# EAGLE schematic All-in-one Starter Kit for ESP32 P4_V1.0 (EAGLE 9.6.2)
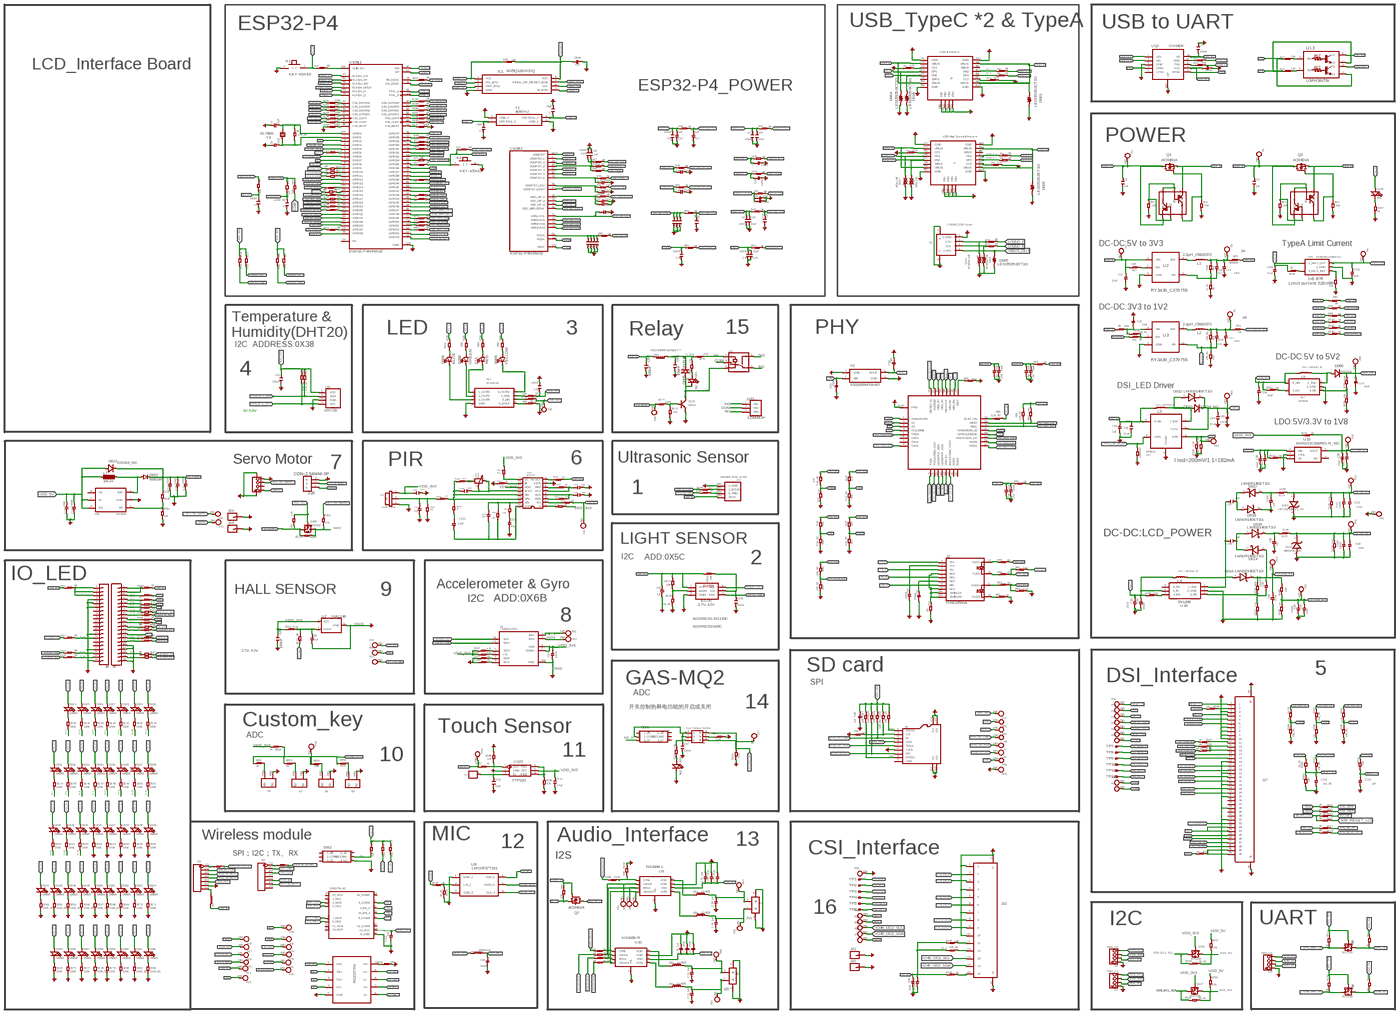
[diagram p0: schematic, sheet 1, overview]
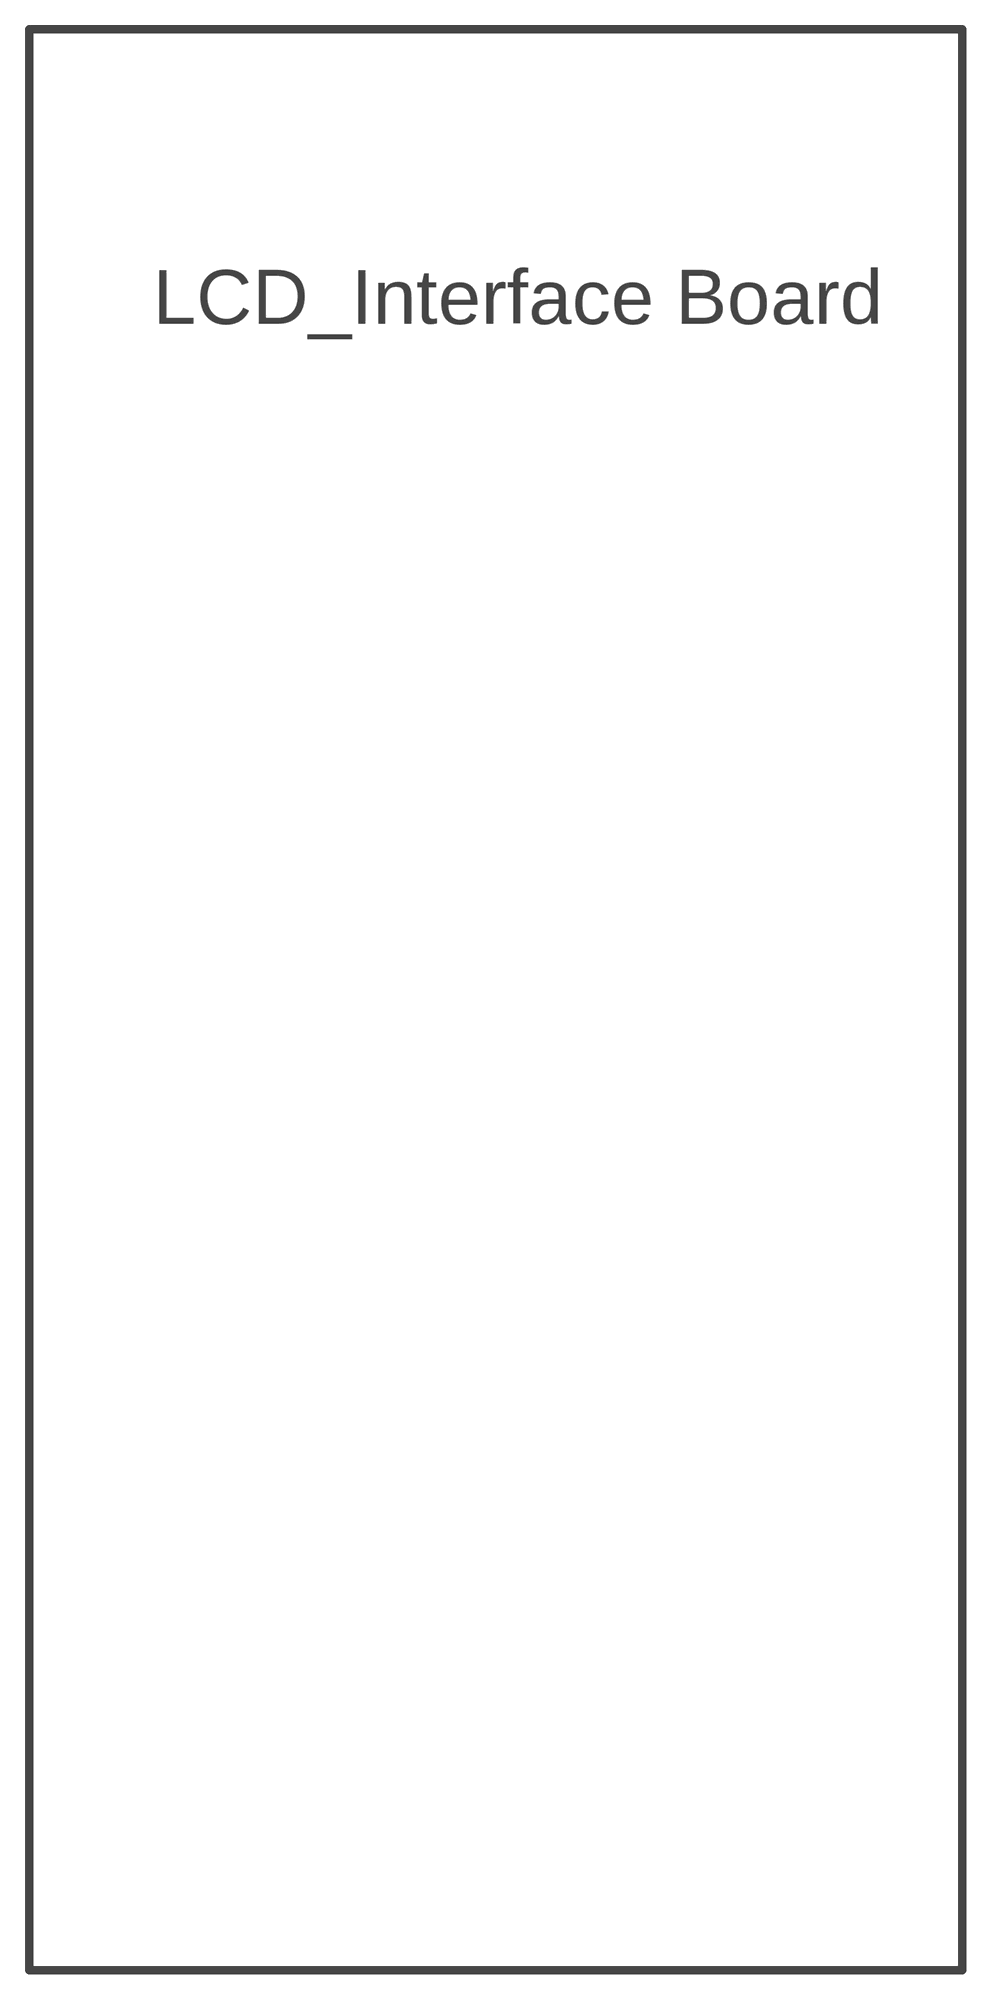
[diagram p1: schematic, sheet 1, part 1 of 8]
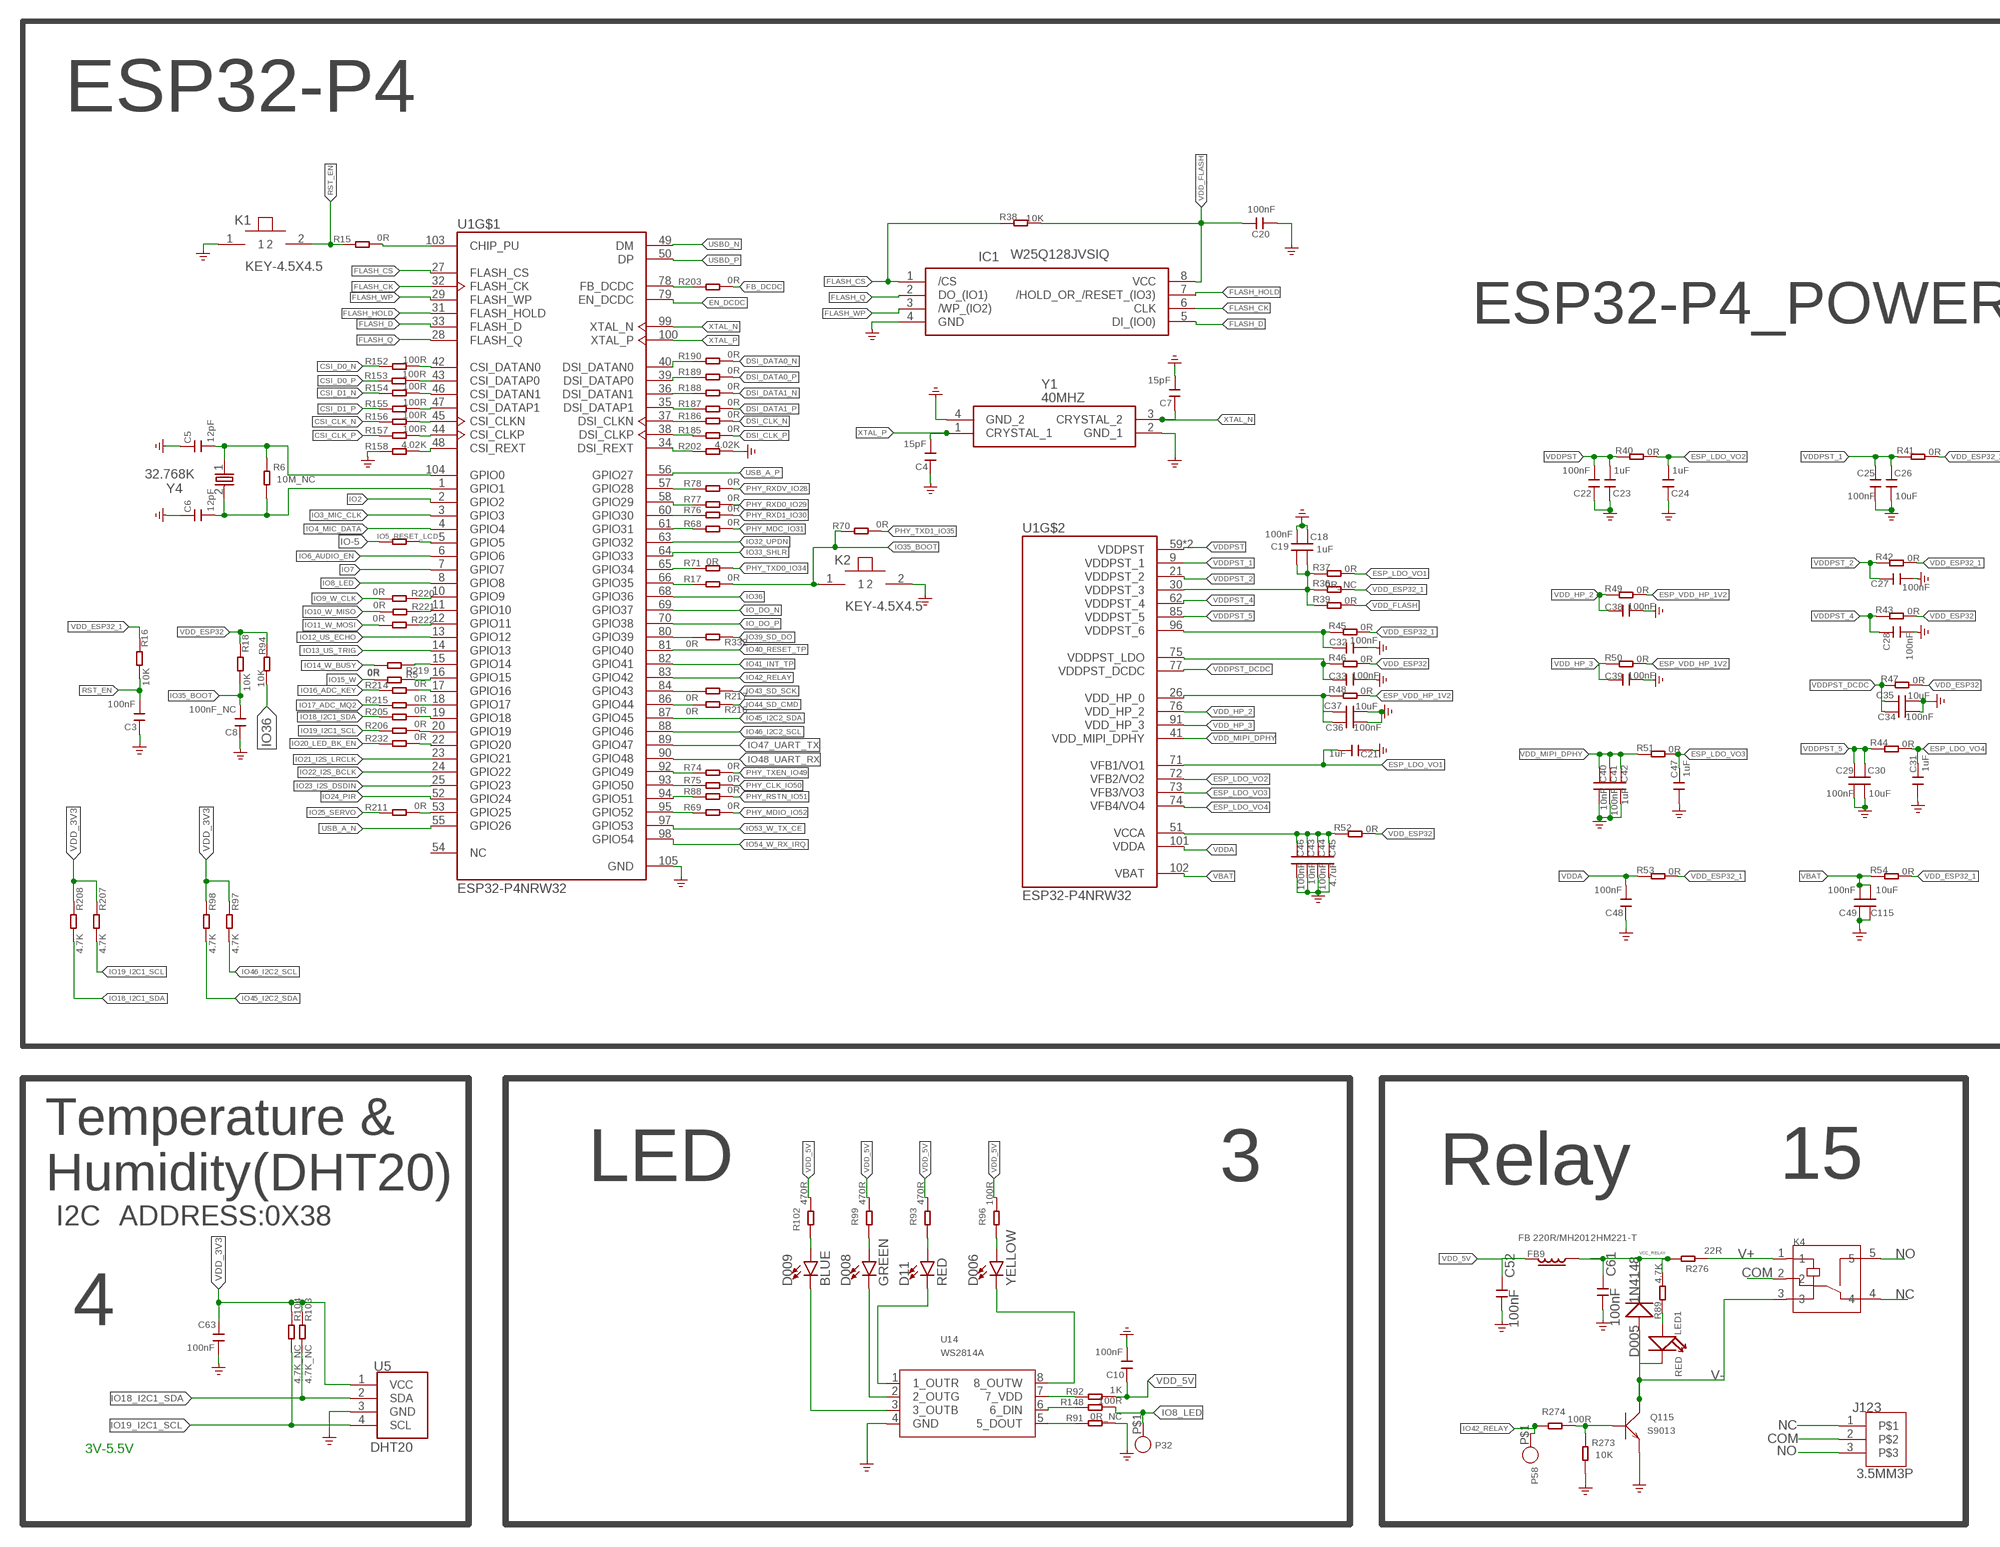
[diagram p2: schematic, sheet 1, part 2 of 8]
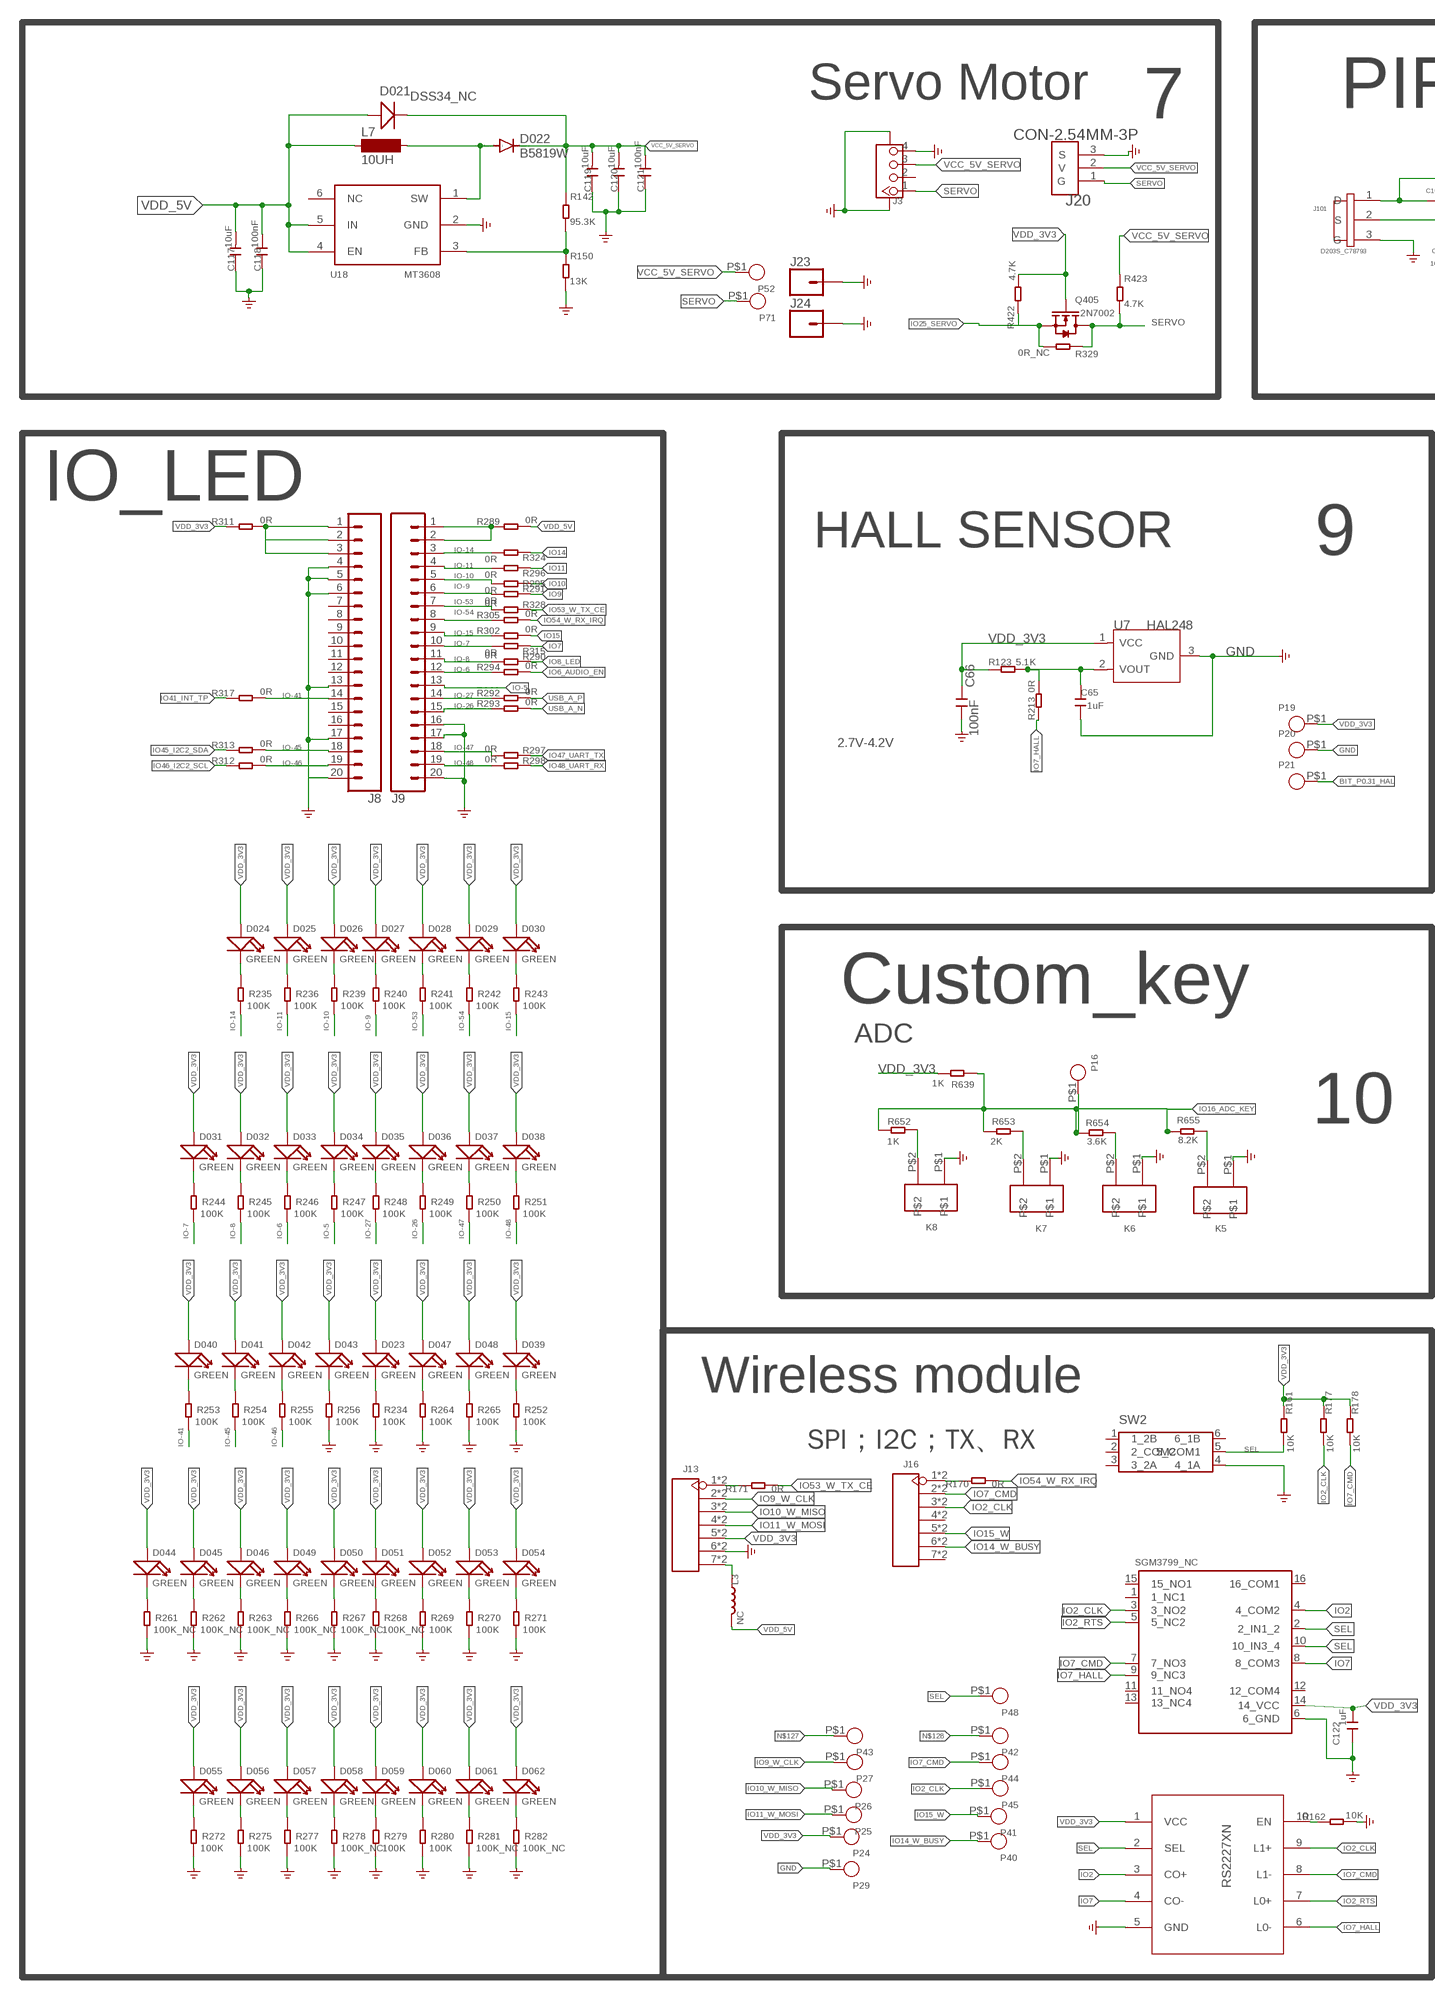
[diagram p3: schematic, sheet 1, part 3 of 8]
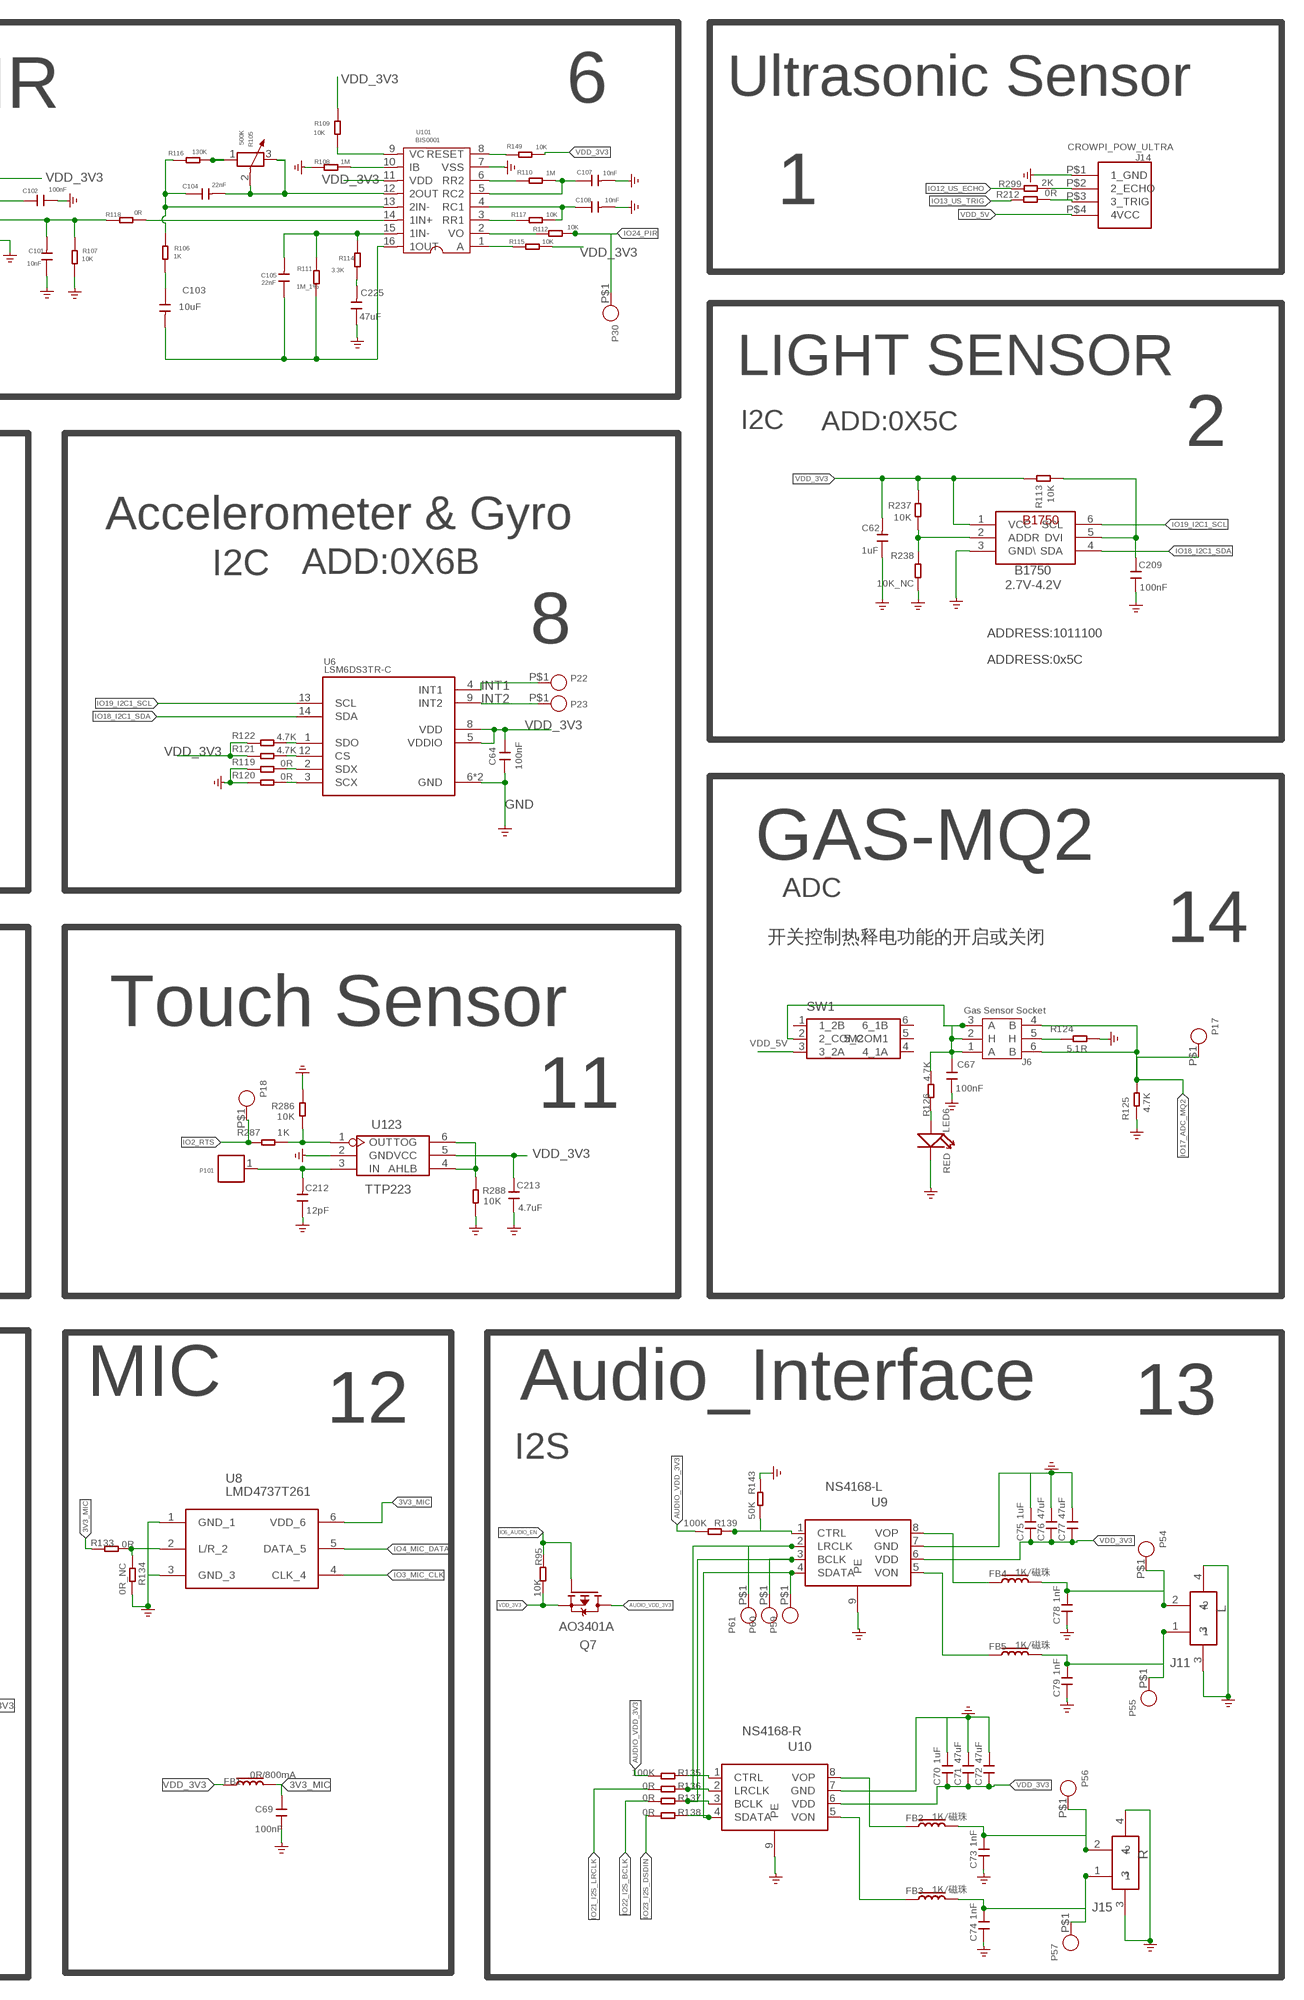
[diagram p4: schematic, sheet 1, part 4 of 8]
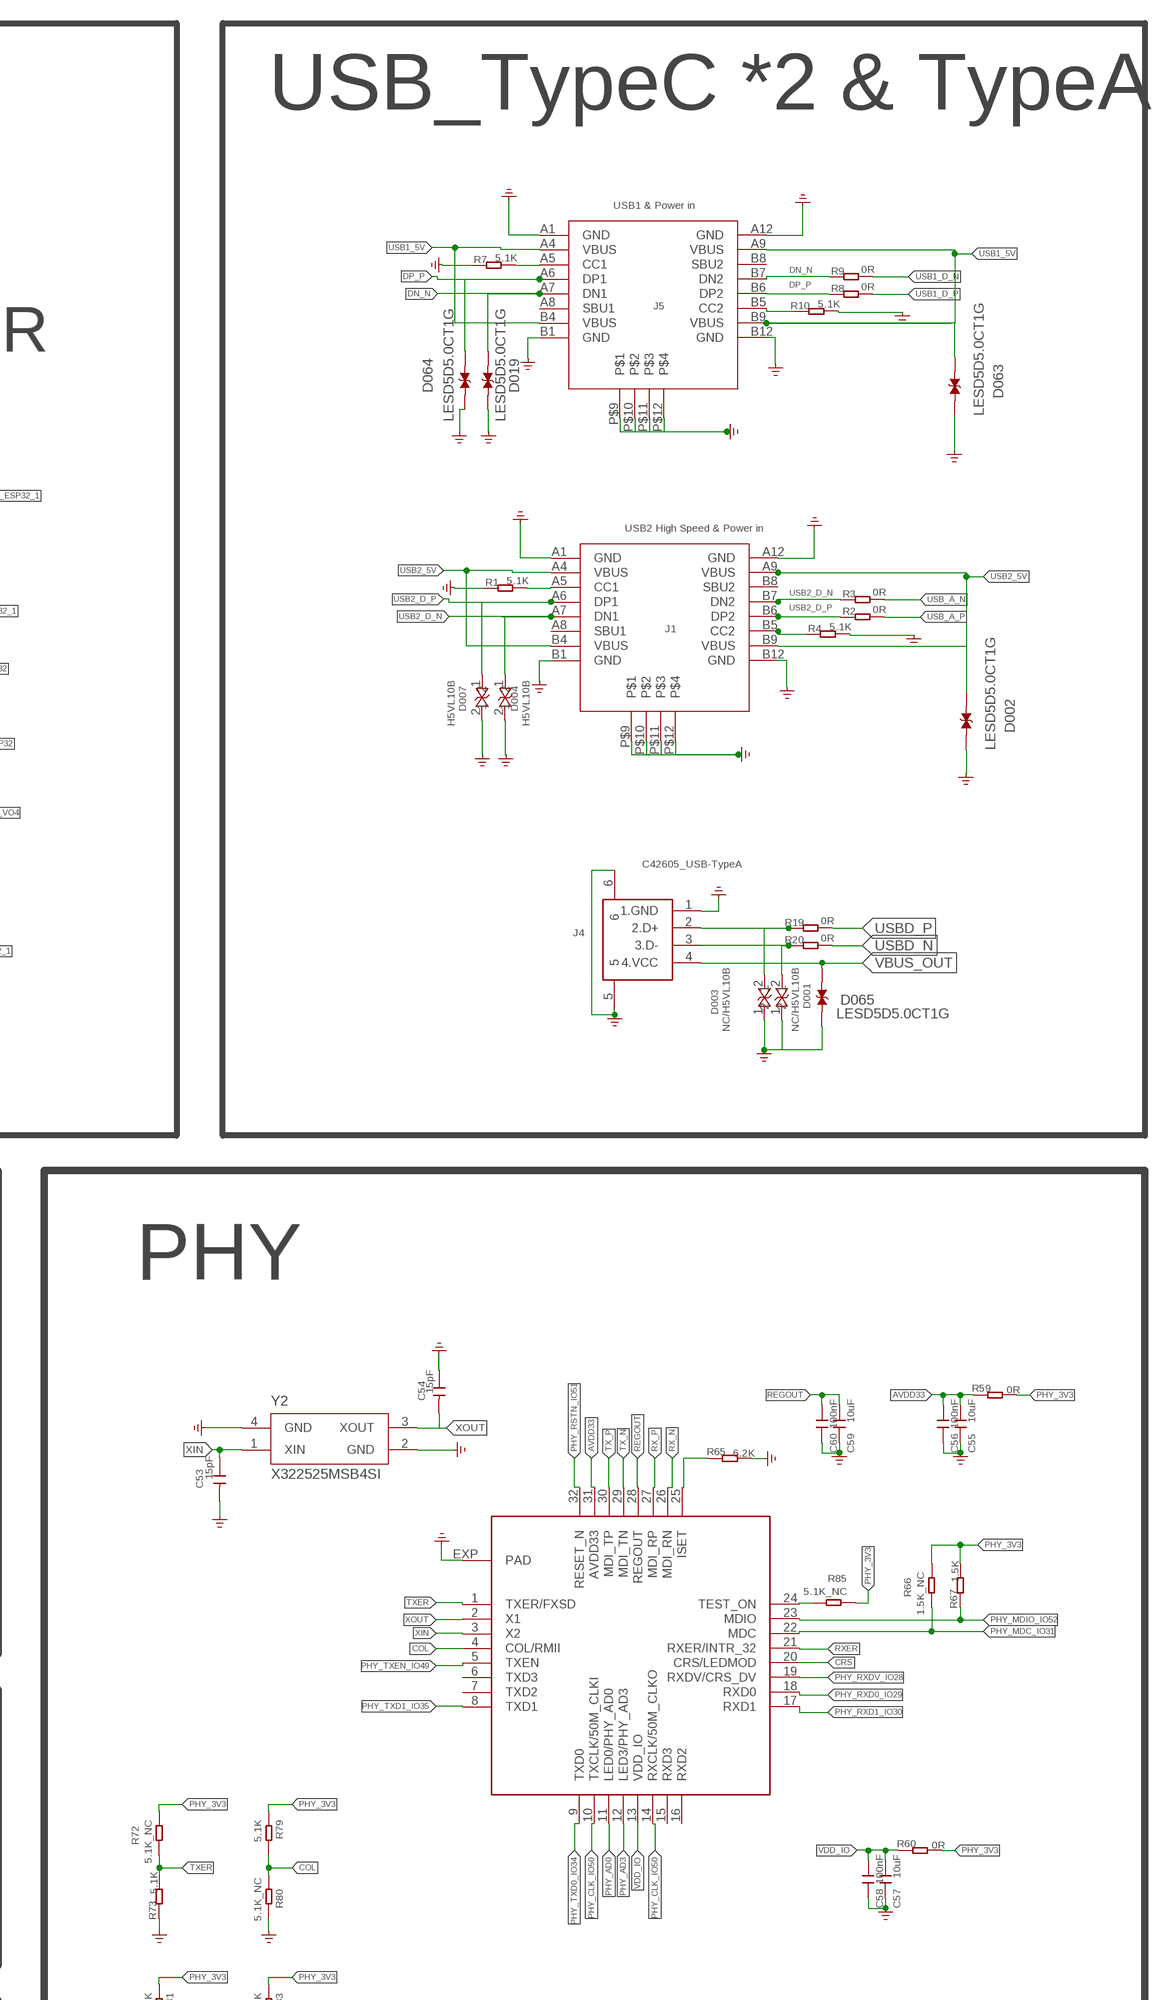
[diagram p5: schematic, sheet 1, part 5 of 8]
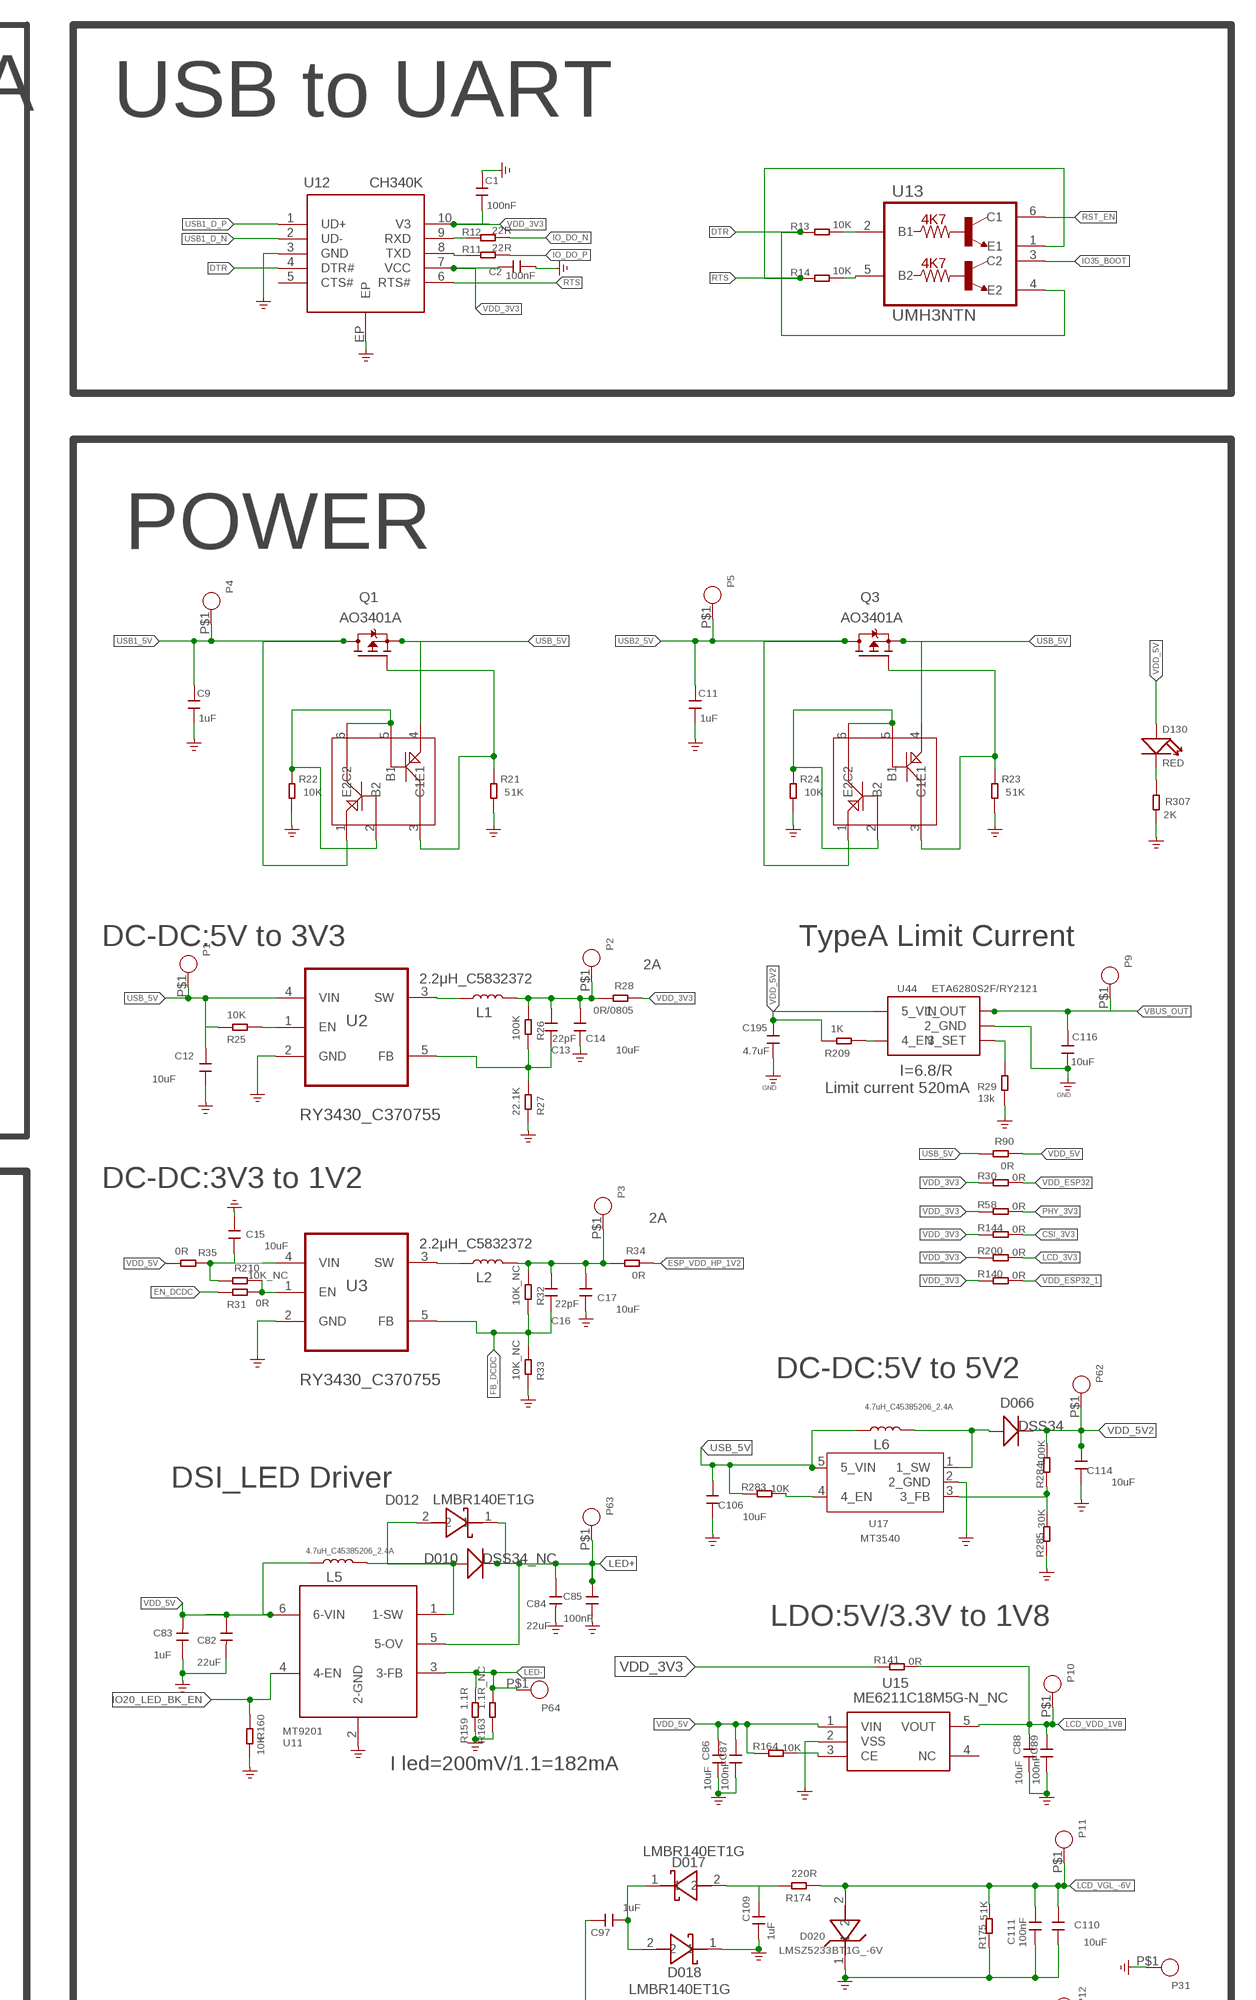
[diagram p6: schematic, sheet 1, part 6 of 8]
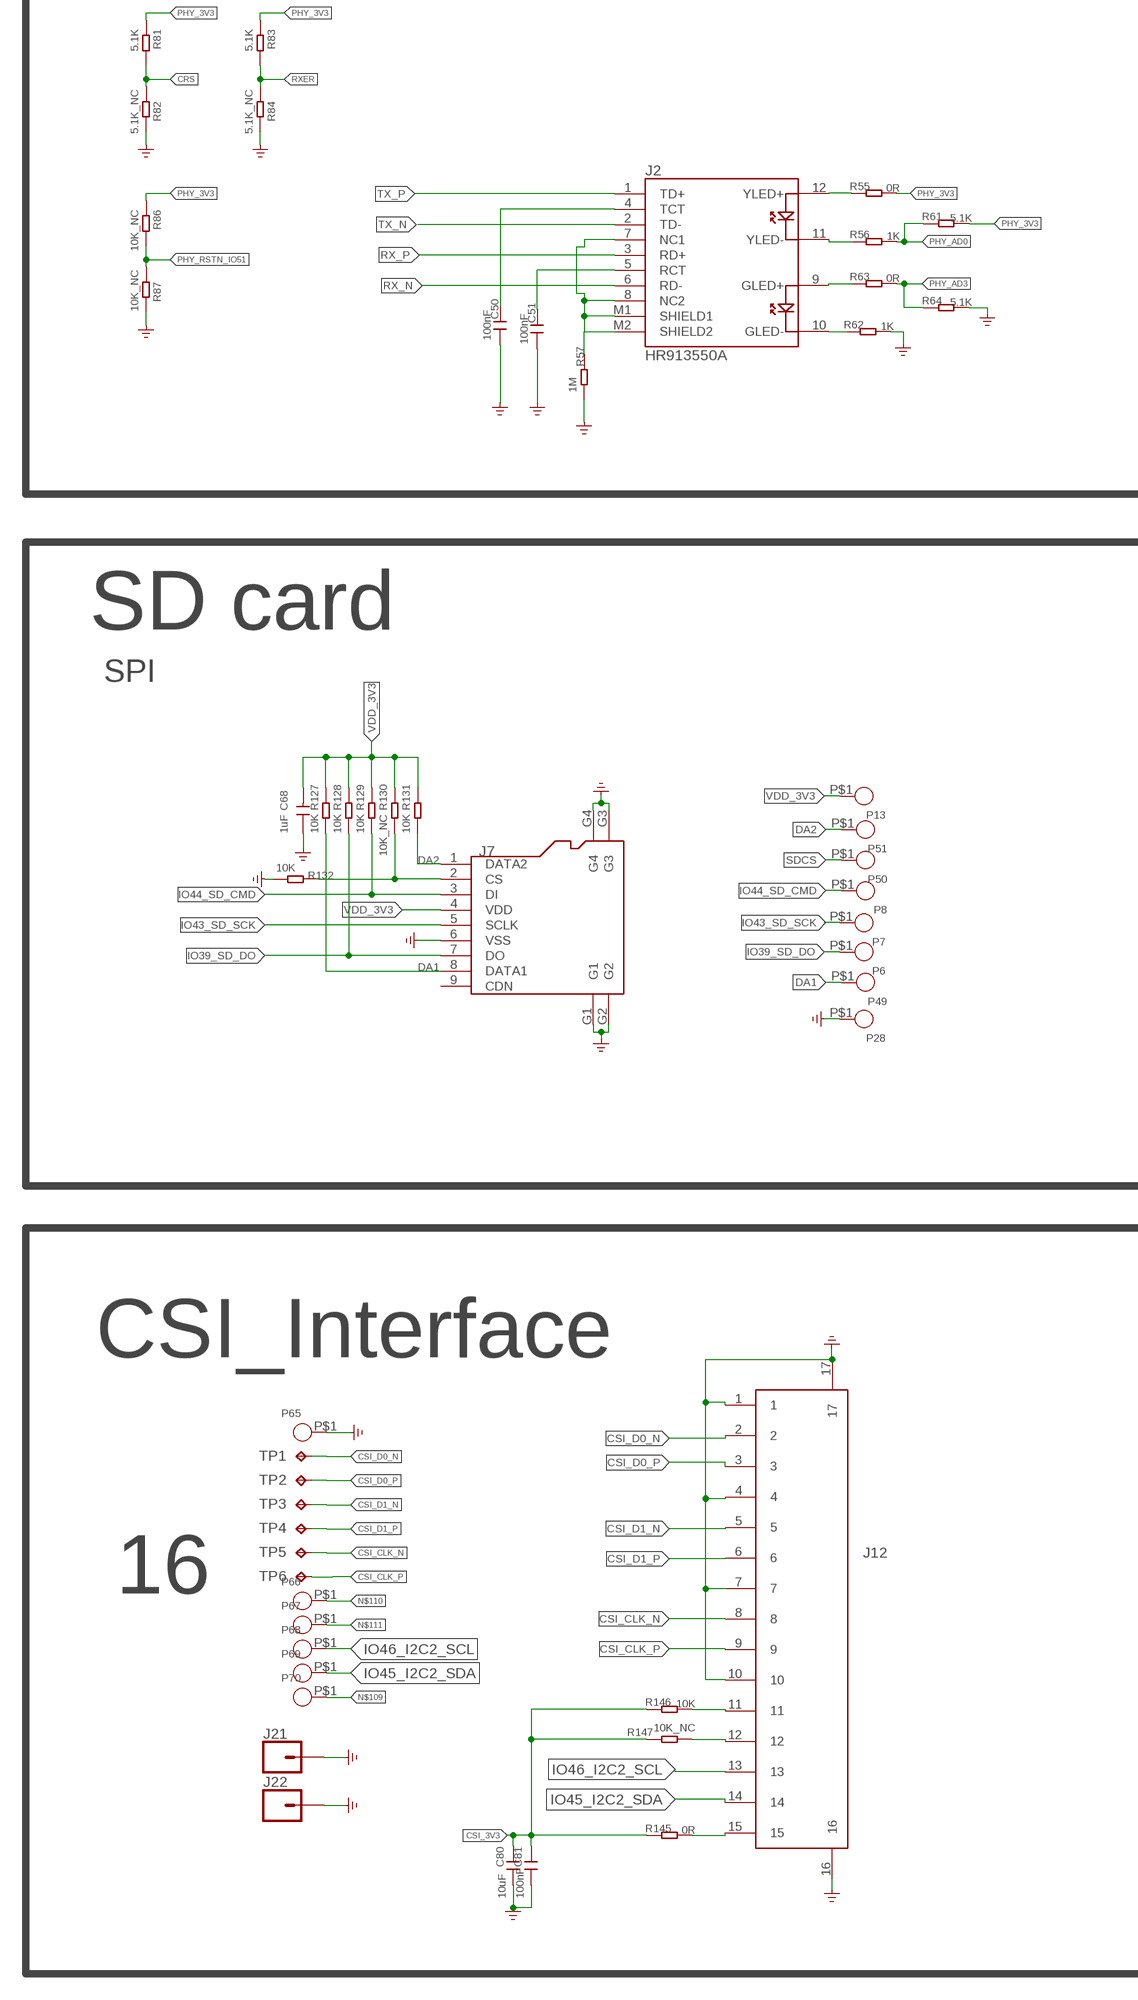
[diagram p7: schematic, sheet 1, part 7 of 8]
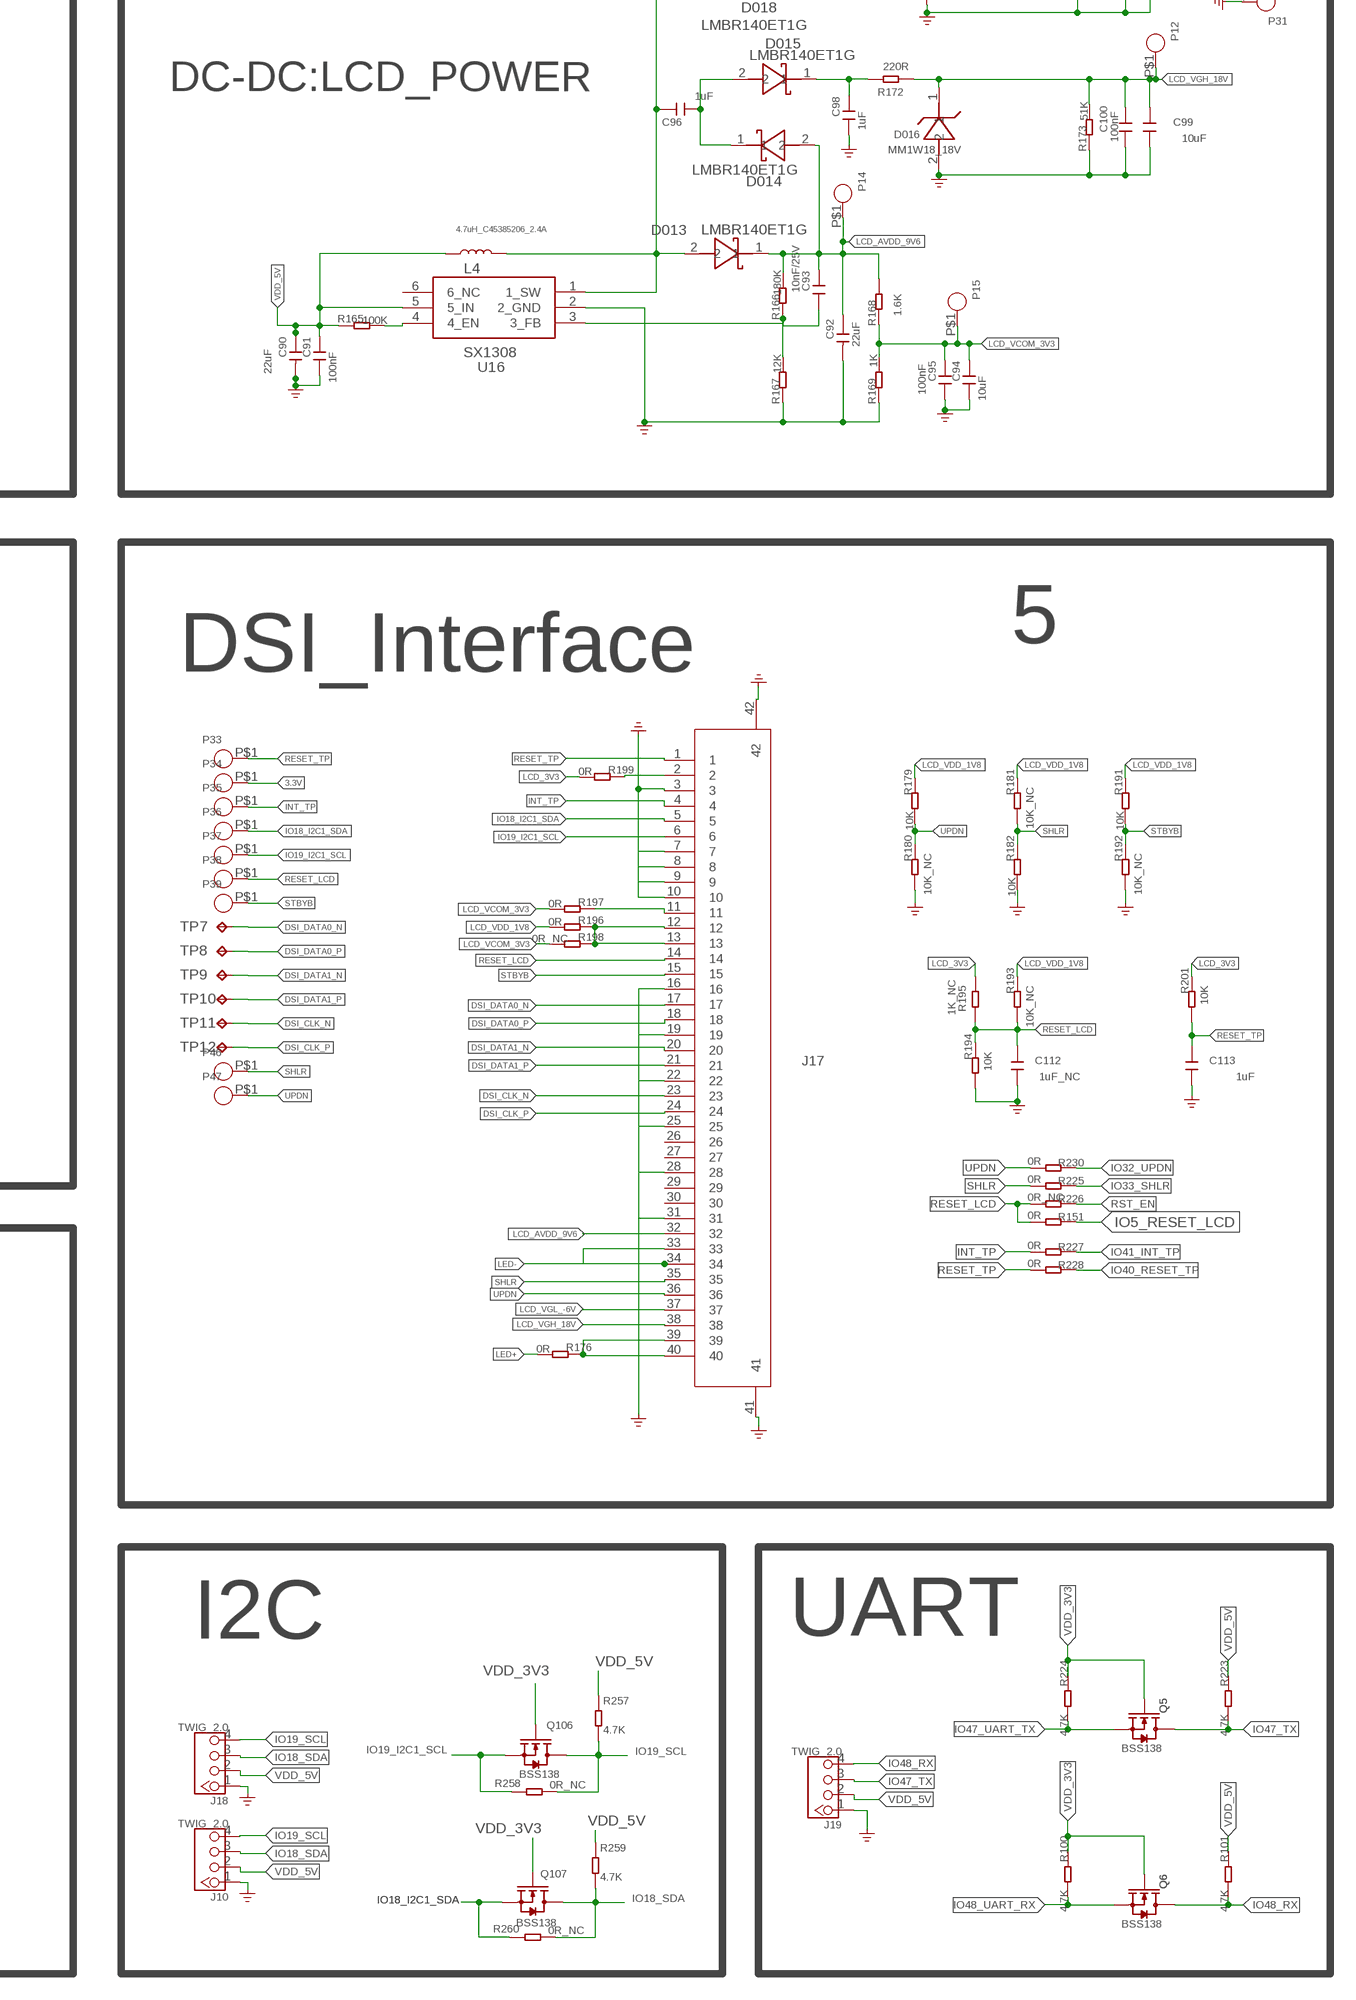
[diagram p8: schematic, sheet 1, part 8 of 8]

## Parts
C1  100nF  C0603  [0603]
C2  100nF  C0603  [0603]
C3  100nF  C0603  [0603]
C4  15pF  C0603  [0603]
C5  12pF  C0603  [0603]
C6  12pF  C0603  [0603]
C7  15pF  C0603  [0603]
C8  100nF_NC  C0603  [0603]
C9  1uF  C0603  [0603]
C10  100nF  C0603  [0603]
C11  1uF  C0603  [0603]
C12  10uF  C0603  [0603]
C13  22pF  C0603  [0603]
C14  10uF  C0603  [0603]
C15  10uF  C0603  [0603]
C16  22pF  C0603  [0603]
C17  10uF  C0603  [0603]
C18  1uF  C0603  [0603]
C19  100nF  C0603  [0603]
C20  100nF  C0603  [0603]
C21  1uF  C0603  [0603]
C22  100nF  C0603  [0603]
C23  1uF  C0603  [0603]
C24  1uF  C0603  [0603]
C25  100nF  C0603  [0603]
C26  10uF  C0603  [0603]
C27  100nF  C0603  [0603]
C28  100nF  C0603  [0603]
C29  100nF  C0603  [0603]
C30  10uF  C0603  [0603]
C31  1uF  C0603  [0603]
C32  100nF  C0603  [0603]
C33  100nF  C0603  [0603]
C34  100nF  C0603  [0603]
C35  10uF  C0603  [0603]
C36  100nF  C0603  [0603]
C37  10uF  C0603  [0603]
C38  100nF  C0603  [0603]
C39  100nF  C0603  [0603]
C40  10nF  C0603  [0603]
C41  100nF  C0603  [0603]
C42  1uF  C0603  [0603]
C43  10nF  C0603  [0603]
C44  100nF  C0603  [0603]
C45  4.7uF  C0603  [0603]
C46  100nF  C0603  [0603]
C47  1uF  C0603  [0603]
C48  100nF  C0603  [0603]
C49  100nF  C0603  [0603]
C50  100nF  C0603  [0603]
C51  100nF  C0603  [0603]
C52  100nF  C0603  [0603]
C53  15pF  CAPC0603  [C0603]
C54  15pF  CAPC0603  [C0603]
C55  10uF  C0603  [0603]
C56  100nF  C0603  [0603]
C57  10uF  C0603  [0603]
C58  100nF  C0603  [0603]
C59  10uF  C0603  [0603]
C60  100nF  C0603  [0603]
C61  100nF  C0603  [0603]
C62  1uF  CAPC0603  [C0603]
C63  100nF  C0603  [0603]
C64  100nF  C0603  [0603]
C65  1uF  C0603  [0603]
C66  100nF  C0603  [0603]
C67  100nF  C0603  [0603]
C68  1uF  CAP  [C0603]
C69  100nF  C0603  [0603]
C70  1uF  C0603  [0603]
C71  47uF  C0603  [0603]
C72  47uF  C0603  [0603]
C73  1nF  C0603  [0603]
C74  1nF  C0603  [0603]
C75  1uF  C0603  [0603]
C76  47uF  C0603  [0603]
C77  47uF  C0603  [0603]
C78  1nF  C0603  [0603]
C79  1nF  C0603  [0603]
C80  10uF  C0603  [0603]
C81  100nF  C0603  [0603]
C82  22uF  CAPC0805  [C0805]
C83  1uF  CAP  [C0603]
C84  22uF  CAPC0805  [C0805]
C85  100nF  C0603  [0603]
C86  10uF  C0603  [0603]
C87  100nF  C0603  [0603]
C88  10uF  C0603  [0603]
C89  100nF  C0603  [0603]
C90  22uF  C0805  [C0805]
C91  100nF  C0603  [0603]
C92  22uF  C0805  [C0805]
C93  10nF/25V  C0603  [0603]
C94  10uF  C0603  [0603]
C95  100nF  C0603  [0603]
C96  1uF  C0603  [0603]
C97  1uF  C0603  [0603]
C98  1uF  C0603  [0603]
C99  10uF  C0603  [0603]
C100  100nF  C0603  [0603]
C101  10nF  C-0603  [C0603]
C102  100nF  C0603  [0603]
C103  10uF  C0603  [0603]
C104  22nF  C-0603  [C0603]
C105  22nF  C-0603  [C0603]
C106  10uF  C0603  [0603]
C107  10nF  C-0603  [C0603]
C108  10nF  C-0603  [C0603]
C109  1uF  C0603  [0603]
C110  10uF  C0603  [0603]
C111  100nF  C0603  [0603]
C112  1uF_NC  C0603  [0603]
C113  1uF  C0603  [0603]
C114  10uF  C0603  [0603]
C115  10uF  C0603  [0603]
C116  10uF  C0603  [0603]
C117  10uF  CAP  [C0603]
C118  100nF  C0603  [0603]
C119  10uF  CAP  [C0603]
C120  10uF  CAP  [C0603]
C121  100nF  C0603  [0603]
C122  1uF  C0603  [0603]
C195  4.7uF  C0603  [0603]
C209  100nF  C0603  [0603]
C212  12pF  CAPC0603  [C0603]
C213  4.7uF  C0603  [0603]
C225  47uF  CAPC0805  [C0805]
D001  NC/H5VL10B  H5VL10B  [H5VL10B]
D002  LESD5D5.0CT1G  [TVS_LESD5D5.0CT1G]
D003  NC/H5VL10B  H5VL10B  [H5VL10B]
D004  H5VL10B  [H5VL10B]
D005  1N4148  DIODE1206  [D_SOD123]
D006  YELLOW  LED  [LED-8MM]
D007  H5VL10B  [H5VL10B]
D008  GREEN  LED  [LED-8MM]
D009  BLUE  LED  [LED-8MM]
D010  DSS34_NC  DIODE  [D_SOD123FL]
D11  RED  LED  [LED-8MM]
D012  LMBR140ET1G  [LMBR140ET1G]
D013  LMBR140ET1G  [LMBR140ET1G]
D014  LMBR140ET1G  [LMBR140ET1G]
D015  LMBR140ET1G  [LMBR140ET1G]
D016  MM1W18_18V  LMSZ5233BT1G  [LMSZ5233BT1G]
D017  LMBR140ET1G  [LMBR140ET1G]
D018  LMBR140ET1G  [LMBR140ET1G]
D019  LESD5D5.0CT1G  [TVS_LESD5D5.0CT1G]
D020  LMSZ5233BT1G_-6V  LMSZ5233BT1G  [LMSZ5233BT1G]
D021  DSS34_NC  DIODE  [D_SOD123FL]
D022  B5819W  CGRM4001-G  [SOD-123_MINI-SMA]
D023  GREEN  LED_0603_SMT  [LED_0603_SMT]
D024  GREEN  LED_0603_SMT  [LED_0603_SMT]
D025  GREEN  LED_0603_SMT  [LED_0603_SMT]
D026  GREEN  LED_0603_SMT  [LED_0603_SMT]
D027  GREEN  LED_0603_SMT  [LED_0603_SMT]
D028  GREEN  LED_0603_SMT  [LED_0603_SMT]
D029  GREEN  LED_0603_SMT  [LED_0603_SMT]
D030  GREEN  LED_0603_SMT  [LED_0603_SMT]
D031  GREEN  LED_0603_SMT  [LED_0603_SMT]
D032  GREEN  LED_0603_SMT  [LED_0603_SMT]
D033  GREEN  LED_0603_SMT  [LED_0603_SMT]
D034  GREEN  LED_0603_SMT  [LED_0603_SMT]
D035  GREEN  LED_0603_SMT  [LED_0603_SMT]
D036  GREEN  LED_0603_SMT  [LED_0603_SMT]
D037  GREEN  LED_0603_SMT  [LED_0603_SMT]
D038  GREEN  LED_0603_SMT  [LED_0603_SMT]
D039  GREEN  LED_0603_SMT  [LED_0603_SMT]
D040  GREEN  LED_0603_SMT  [LED_0603_SMT]
D041  GREEN  LED_0603_SMT  [LED_0603_SMT]
D042  GREEN  LED_0603_SMT  [LED_0603_SMT]
D043  GREEN  LED_0603_SMT  [LED_0603_SMT]
D044  GREEN  LED_0603_SMT  [LED_0603_SMT]
D045  GREEN  LED_0603_SMT  [LED_0603_SMT]
D046  GREEN  LED_0603_SMT  [LED_0603_SMT]
D047  GREEN  LED_0603_SMT  [LED_0603_SMT]
D048  GREEN  LED_0603_SMT  [LED_0603_SMT]
D049  GREEN  LED_0603_SMT  [LED_0603_SMT]
D050  GREEN  LED_0603_SMT  [LED_0603_SMT]
D051  GREEN  LED_0603_SMT  [LED_0603_SMT]
D052  GREEN  LED_0603_SMT  [LED_0603_SMT]
D053  GREEN  LED_0603_SMT  [LED_0603_SMT]
D054  GREEN  LED_0603_SMT  [LED_0603_SMT]
D055  GREEN  LED_0603_SMT  [LED_0603_SMT]
D056  GREEN  LED_0603_SMT  [LED_0603_SMT]
D057  GREEN  LED_0603_SMT  [LED_0603_SMT]
D058  GREEN  LED_0603_SMT  [LED_0603_SMT]
D059  GREEN  LED_0603_SMT  [LED_0603_SMT]
D060  GREEN  LED_0603_SMT  [LED_0603_SMT]
D061  GREEN  LED_0603_SMT  [LED_0603_SMT]
D062  GREEN  LED_0603_SMT  [LED_0603_SMT]
D063  LESD5D5.0CT1G  [TVS_LESD5D5.0CT1G]
D064  LESD5D5.0CT1G  [TVS_LESD5D5.0CT1G]
D065  LESD5D5.0CT1G  [TVS_LESD5D5.0CT1G]
D066  DSS34  DIODE  [D_SOD123FL]
D130  RED  LED_0603_SMT  [LED_0603_SMT]
FB1  0R/800mA  FBL0603  [L0603]
FB2  1K/磁珠  FBL0603  [L0603]
FB3  1K/磁珠  FBL0603  [L0603]
FB4  1K/磁珠  FBL0603  [L0603]
FB5  1K/磁珠  FBL0603  [L0603]
FB9  FB 220R/MH2012HM221-T  FBL0805  [L0805]
IC1  W25Q128JVSIQ  [SOIC127P790X216-8N]
J1  USB2 High Speed & Power in  WZ3532R024-ESP32-V0.1-20221226_USB_TYPE-C_16PIN3.0USB  [WZ3532R024-ESP32-V0.1-20221226_KEVIN_3.0TYPEC-SMD]
J2  HR913550A  LORA_BASIC_GATEWAY_-MODULE_HR911105A-RJ45  [LORA_BASIC_GATEWAY_-MODULE_HR911105A-RJ45]
J3  A_XBJ_CONNECTOR_TWIG-4P-2.0-SMD-FEMALE-REINFORCE90D  [A_XBJ_CONNECTOR_4P-SMD-2.0-90D]
J4  C42605_USB-TypeA  C42605/USB2.0  [C42605/USB2.0]
J5  USB1 & Power in  WZ3532R024-ESP32-V0.1-20221226_USB_TYPE-C_16PIN3.0USB  [WZ3532R024-ESP32-V0.1-20221226_KEVIN_3.0TYPEC-SMD]
J6  Gas Sensor Socket  MQ-SOCKET  [MQ2]
J7  HOLDER-MICROSD-9P  [9P-SMD-W/-RING]
J8  CONN_20  [1X20]
J9  CONN_20  [1X20]
J10  TWIG_2.0  [2.0_1X4]
J11  L  1X02L  [1X02L]
J12  C262349_15P_1MM_下接_AFA07-S15FCC-00  [C262349_15P_1MM_下接_AFA07-S15FCC-00]
J13  HEADER-7P-18.28X2.5  [H7-2.54-18.28X2.5X5MM]
J14  CROWPI_POW_ULTRA  [CROWPI_POW_ULTRA]
J15  R  1X02L  [1X02L]
J16  HEADER-7P-18.28X2.5  [H7-2.54-18.28X2.5X5MM]
J17  C19273935_40P_0.5MM_下接_HC-FPC-0.5-40P-FH20  [C19273935_40P_0.5MM_下接_HC-FPC-0.5-40P-FH20]
J18  TWIG_2.0  [2.0_1X4]
J19  TWIG_2.0  [2.0_1X4]
J20  CON-2.54MM-3P  CON-2.54MM-13P-WT-SG90  [CON-PZ-2.54MM-1*3P-WT]
J21  CONN_01_3.1MM_SMD1X01_3.1MM_SMD  [1X01_2MM]
J22  CONN_01_3.1MM_SMD1X01_3.1MM_SMD  [1X01_2MM]
J23  CONN_01_2.6MM1X01_2.6-4MM  [1X01_2.6MM]
J24  CONN_01_2.6MM1X01_2.6-4MM  [1X01_2.6MM]
J101  D203S_C78793  LHI778  [3P-D8.1MM]
J123  3.5MM3P  [3.5MM*3P]
K1  KEY-4.5X4.5  KEY-6KEY-4.5X4.5  [KEY-4.5X4.5-SMD]
K2  KEY-4.5X4.5  KEY-6KEY-4.5X4.5  [KEY-4.5X4.5-SMD]
K4  RELAY-SRD  [REY5-6-19.1X15.5X15.3MM]
K5  BUTTON_2P  [BUTTON_2P]
K6  BUTTON_2P  [BUTTON_2P]
K7  BUTTON_2P  [BUTTON_2P]
K8  BUTTON_2P  [BUTTON_2P]
L1  2.2μH_C5832372  4.7μH_SHIELDED_INDUCTOR  [1008(2520)]
L2  2.2μH_C5832372  4.7μH_SHIELDED_INDUCTOR  [1008(2520)]
L3  NC  L0603  [L0603]
L4  4.7uH_C45385206_2.4A  4.7μH_SHIELDED_INDUCTOR  [1008(2520)]
L5  4.7uH_C45385206_2.4A  4.7μH_SHIELDED_INDUCTOR  [1008(2520)]
L6  4.7uH_C45385206_2.4A  4.7μH_SHIELDED_INDUCTOR  [1008(2520)]
L7  10UH  MS42SMD-4X4MM  [SMD-4X4MM]
LED1  RED  DISCRETE_LED0603  [DISCRETE_LED-0603]
LED6  RED  DISCRETE_LED0603  [DISCRETE_LED-0603]
P1  TEST_PADPAD-1.5MM  [TEST_PAD-1.5MM]
P2  TEST_PADPAD-1.5MM  [TEST_PAD-1.5MM]
P3  TEST_PADPAD-1.5MM  [TEST_PAD-1.5MM]
P4  TEST_PADPAD-1.5MM  [TEST_PAD-1.5MM]
P5  TEST_PADPAD-1.5MM  [TEST_PAD-1.5MM]
P6  TEST_PADPAD-1.5MM  [TEST_PAD-1.5MM]
P7  TEST_PADPAD-1.5MM  [TEST_PAD-1.5MM]
P8  TEST_PADPAD-1.5MM  [TEST_PAD-1.5MM]
P9  TEST_PADPAD-1.5MM  [TEST_PAD-1.5MM]
P10  TEST_PADPAD-1.5MM  [TEST_PAD-1.5MM]
P11  TEST_PADPAD-1.5MM  [TEST_PAD-1.5MM]
P12  TEST_PADPAD-1.5MM  [TEST_PAD-1.5MM]
P13  TEST_PADPAD-1.5MM  [TEST_PAD-1.5MM]
P14  TEST_PADPAD-1.5MM  [TEST_PAD-1.5MM]
P15  TEST_PADPAD-1.5MM  [TEST_PAD-1.5MM]
P16  TEST_PADPAD-1.5MM  [TEST_PAD-1.5MM]
P17  TEST_PADPAD-1.5MM  [TEST_PAD-1.5MM]
P18  TEST_PADPAD-1.5MM  [TEST_PAD-1.5MM]
P19  TEST_PADPAD-1.5MM  [TEST_PAD-1.5MM]
P20  TEST_PADPAD-1.5MM  [TEST_PAD-1.5MM]
P21  TEST_PADPAD-1.5MM  [TEST_PAD-1.5MM]
P22  TEST_PADPAD-1.5MM  [TEST_PAD-1.5MM]
P23  TEST_PADPAD-1.5MM  [TEST_PAD-1.5MM]
P24  TEST_PADPAD-1.5MM  [TEST_PAD-1.5MM]
P25  TEST_PADPAD-1.5MM  [TEST_PAD-1.5MM]
P26  TEST_PADPAD-1.5MM  [TEST_PAD-1.5MM]
P27  TEST_PADPAD-1.5MM  [TEST_PAD-1.5MM]
P28  TEST_PADPAD-1.5MM  [TEST_PAD-1.5MM]
P29  TEST_PADPAD-1.5MM  [TEST_PAD-1.5MM]
P30  TEST_PADPAD-1.5MM  [TEST_PAD-1.5MM]
P31  TEST_PADPAD-1.5MM  [TEST_PAD-1.5MM]
P32  TEST_PADPAD-1.5MM  [TEST_PAD-1.5MM]
P33  TEST_PADPAD-1.5MM  [TEST_PAD-1.5MM]
P34  TEST_PADPAD-1.5MM  [TEST_PAD-1.5MM]
P35  TEST_PADPAD-1.5MM  [TEST_PAD-1.5MM]
P36  TEST_PADPAD-1.5MM  [TEST_PAD-1.5MM]
P37  TEST_PADPAD-1.5MM  [TEST_PAD-1.5MM]
P38  TEST_PADPAD-1.5MM  [TEST_PAD-1.5MM]
P39  TEST_PADPAD-1.5MM  [TEST_PAD-1.5MM]
P40  TEST_PADPAD-1.5MM  [TEST_PAD-1.5MM]
P41  TEST_PADPAD-1.5MM  [TEST_PAD-1.5MM]
P42  TEST_PADPAD-1.5MM  [TEST_PAD-1.5MM]
P43  TEST_PADPAD-1.5MM  [TEST_PAD-1.5MM]
P44  TEST_PADPAD-1.5MM  [TEST_PAD-1.5MM]
P45  TEST_PADPAD-1.5MM  [TEST_PAD-1.5MM]
P46  TEST_PADPAD-1.5MM  [TEST_PAD-1.5MM]
P47  TEST_PADPAD-1.5MM  [TEST_PAD-1.5MM]
P48  TEST_PADPAD-1.5MM  [TEST_PAD-1.5MM]
P49  TEST_PADPAD-1.5MM  [TEST_PAD-1.5MM]
P50  TEST_PADPAD-1.5MM  [TEST_PAD-1.5MM]
P51  TEST_PADPAD-1.5MM  [TEST_PAD-1.5MM]
P52  TEST_PADPAD-1.5MM  [TEST_PAD-1.5MM]
P54  TEST_PADPAD-1.5MM  [TEST_PAD-1.5MM]
P55  TEST_PADPAD-1.5MM  [TEST_PAD-1.5MM]
P56  TEST_PADPAD-1.5MM  [TEST_PAD-1.5MM]
P57  TEST_PADPAD-1.5MM  [TEST_PAD-1.5MM]
P58  TEST_PADPAD-1.5MM  [TEST_PAD-1.5MM]
P59  TEST_PADPAD-1.5MM  [TEST_PAD-1.5MM]
P60  TEST_PADPAD-1.5MM  [TEST_PAD-1.5MM]
P61  TEST_PADPAD-1.5MM  [TEST_PAD-1.5MM]
P62  TEST_PADPAD-1.5MM  [TEST_PAD-1.5MM]
P63  TEST_PADPAD-1.5MM  [TEST_PAD-1.5MM]
P64  TEST_PADPAD-1.5MM  [TEST_PAD-1.5MM]
P65  TEST_PADPAD-1.5MM  [TEST_PAD-1.5MM]
P66  TEST_PADPAD-1.5MM  [TEST_PAD-1.5MM]
P67  TEST_PADPAD-1.5MM  [TEST_PAD-1.5MM]
P68  TEST_PADPAD-1.5MM  [TEST_PAD-1.5MM]
P69  TEST_PADPAD-1.5MM  [TEST_PAD-1.5MM]
P70  TEST_PADPAD-1.5MM  [TEST_PAD-1.5MM]
P71  TEST_PADPAD-1.5MM  [TEST_PAD-1.5MM]
P101  KEY  PAD'D450MIL'  [1P-D450]
Q1  AO3401A  [SOT23-3]
Q2  LMBT3906DW1T1G  [LMBT3906DW1T1G]
Q3  AO3401A  [SOT23-3]
Q4  LMBT3906DW1T1G  [LMBT3906DW1T1G]
Q5  BSS138  MOSFET-N'SOT23'  [SOT23]
Q6  BSS138  MOSFET-N'SOT23'  [SOT23]
Q7  AO3401A  [SOT23-3]
Q106  BSS138  MOSFET-N'SOT23'  [SOT23]
Q107  BSS138  MOSFET-N'SOT23'  [SOT23]
Q115  S9013  TRANSISTOR-NPN-SOT23  [SOT23@1]
Q405  2N7002  MOSFET-N'SOT23'  [SOT23]
R1  5.1K  R-0603  [R0603]
R2  0R  R-0603  [R0603]
R3  0R  R-0603  [R0603]
R4  5.1K  R-0603  [R0603]
R5  0R  R-0603  [R0603]
R6  10M_NC  R-0603  [R0603]
R7  5.1K  R-0603  [R0603]
R8  0R  R-0603  [R0603]
R9  0R  R-0603  [R0603]
R10  5.1K  R-0603  [R0603]
R11  22R  R-0603  [R0603]
R12  22R  R-0603  [R0603]
R13  10K  R-0603  [R0603]
R14  10K  R-0603  [R0603]
R15  0R  R-0603  [R0603]
R16  10K  R-0603  [R0603]
R17  0R  R-0603  [R0603]
R18  10K  R-0603  [R0603]
R19  0R  R-0603  [R0603]
R20  0R  R-0603  [R0603]
R21  51K  R-0603  [R0603]
R22  10K  R-0603  [R0603]
R23  51K  R-0603  [R0603]
R24  10K  R-0603  [R0603]
R25  10K  R0603  [R0603]
R26  100K  R0603  [R0603]
R27  22.1K  R0603  [R0603]
R28  0R/0805  RES-0805  [R0805-SP]
R29  13k  R0603  [R0603]
R30  0R  R0603  [R0603]
R31  0R  R0603  [R0603]
R32  10K_NC  R0603  [R0603]
R33  10K_NC  R0603  [R0603]
R34  0R  R0603  [R0603]
R35  0R  R0603  [R0603]
R36  0R_NC  R0603  [R0603]
R37  0R  R0603  [R0603]
R38  10K  R0603  [R0603]
R39  0R  R0603  [R0603]
R40  0R  R0603  [R0603]
R41  0R  R0603  [R0603]
R42  0R  R0603  [R0603]
R43  0R  R0603  [R0603]
R44  0R  R0603  [R0603]
R45  0R  R0603  [R0603]
R46  0R  R0603  [R0603]
R47  0R  R0603  [R0603]
R48  0R  R0603  [R0603]
R49  0R  R0603  [R0603]
R50  0R  R0603  [R0603]
R51  0R  R0603  [R0603]
R52  0R  R0603  [R0603]
R53  0R  R0603  [R0603]
R54  0R  R0603  [R0603]
R55  0R  R0603  [R0603]
R56  1K  R0603  [R0603]
R57  1M  RESR0603  [R0603]
R58  0R  R0603  [R0603]
R59  0R  R0603  [R0603]
R60  0R  R0603  [R0603]
R61  5.1K  R0603  [R0603]
R62  1K  R0603  [R0603]
R63  0R  R0603  [R0603]
R64  5.1K  R0603  [R0603]
R65  6.2K  R0603  [R0603]
R66  1.5K_NC  R0603  [R0603]
R67  1.5K  R0603  [R0603]
R68  0R  R-0603  [R0603]
R69  0R  R-0603  [R0603]
R70  0R  R-0603  [R0603]
R71  0R  R-0603  [R0603]
R72  5.1K_NC  R0603  [R0603]
R73  5.1K  R0603  [R0603]
R74  0R  R-0603  [R0603]
R75  0R  R-0603  [R0603]
R76  0R  R-0603  [R0603]
R77  0R  R-0603  [R0603]
R78  0R  R-0603  [R0603]
R79  5.1K  R0603  [R0603]
R80  5.1K_NC  R0603  [R0603]
R81  5.1K  R0603  [R0603]
R82  5.1K_NC  R0603  [R0603]
R83  5.1K  R0603  [R0603]
R84  5.1K_NC  R0603  [R0603]
R85  5.1K_NC  R0603  [R0603]
R86  10K_NC  R0603  [R0603]
R87  10K_NC  R0603  [R0603]
R88  0R  R-0603  [R0603]
R89  4.7K  RESR0603  [R0603]
R90  0R  RES-0805  [R0805-SP]
R91  0R_NC  R-0603  [R0603]
R92  1K  R-0603  [R0603]
R93  470R  R-0603  [R0603]
R94  10K  R0603  [R0603]
R95  10K  R0603  [R0603]
R96  100R  R-0603  [R0603]
R97  4.7K  R0603  [R0603]
R98  4.7K  R0603  [R0603]
R99  470R  R-0603  [R0603]
R100  4.7K  RES-0603  [R0603-SP]
R101  4.7K  RES-0603  [R0603-SP]
R102  470R  R-0603  [R0603]
R103  4.7K_NC  R0603  [R0603]
R104  4.7K_NC  R0603  [R0603]
R105  500K  R-POTENTIOMETER-SMD  [3P-SMD-SQUA-3.6X3.3]
R106  1K  R-0603  [R0603]
R107  10K  R-0603  [R0603]
R108  1M  R-0603  [R0603]
R109  10K  R-0603  [R0603]
R110  1M  R-0603  [R0603]
R111  1M_1%  R-0603  [R0603]
R112  10K  R-0603  [R0603]
R113  10K  RESR0603  [R0603]
R114  3.3K  R-0603  [R0603]
R115  10K  R-0603  [R0603]
R116  130K  R-0603  [R0603]
R117  10K  R-0603  [R0603]
R118  0R  R-0603  [R0603]
R119  0R  RESR0603  [R0603]
R120  0R  RESR0603  [R0603]
R121  4.7K  RESR0603  [R0603]
R122  4.7K  RESR0603  [R0603]
R123  5.1K  R-0603  [R0603]
R124  5.1R  RESR0603  [R0603]
R125  4.7K  RESR0603  [R0603]
R126  4.7K  RESR0603  [R0603]
R127  10K  RES-0603  [R0603-SP]
R128  10K  RES-0603  [R0603-SP]
R129  10K  RES-0603  [R0603-SP]
R130  10K_NC  RES-0603  [R0603-SP]
R131  10K  RES-0603  [R0603-SP]
R132  10K  RES-0603  [R0603-SP]
R133  0R  R0603  [R0603]
R134  0R_NC  R0603  [R0603]
R135  100K  RES-0603  [R0603-SP]
R136  0R  RES-0603  [R0603-SP]
R137  0R  RES-0603  [R0603-SP]
R138  0R  RES-0603  [R0603-SP]
R139  100K  RES-0603  [R0603-SP]
R140  0R  R0603  [R0603]
R141  0R  R0603  [R0603]
R142  95.3K  RESR0603  [R0603]
R143  50K  RES-0603  [R0603-SP]
R144  0R  R0603  [R0603]
R145  0R  R0603  [R0603]
R146  10K  R0603  [R0603]
R147  10K_NC  R0603  [R0603]
R148  100R  R-0603  [R0603]
R149  10K  R-0603  [R0603]
R150  13K  RESR0603  [R0603]
R151  0R  R0603  [R0603]
R152  100R  R-0603  [R0603]
R153  100R  R-0603  [R0603]
R154  100R  R-0603  [R0603]
R155  100R  R-0603  [R0603]
R156  100R  R-0603  [R0603]
R157  100R  R-0603  [R0603]
R158  4.02K  R-0603  [R0603]
R159  1.1R  RES-0603  [R0603-SP]
R160  10K  RES-0603  [R0603-SP]
R161  10K  R-0603  [R0603]
R162  10K  R-0603  [R0603]
R163  1.1R_NC  RES-0603  [R0603-SP]
R164  10K  R0603  [R0603]
R165  100K  R0603  [R0603]
R166  180K  R0603  [R0603]
R167  12K  R0603  [R0603]
R168  1.6K  R0603  [R0603]
R169  1K  R0603  [R0603]
R170  0R  RES-0603  [R0603-SP]
R171  0R  RES-0603  [R0603-SP]
R172  220R  R0603  [R0603]
R173  51K  R0603  [R0603]
R174  220R  R0603  [R0603]
R175  51K  R0603  [R0603]
R176  0R  R0603  [R0603]
R177  10K  R-0603  [R0603]
R178  10K  R-0603  [R0603]
R179  10K  R0603  [R0603]
R180  10K_NC  R0603  [R0603]
R181  10K_NC  R0603  [R0603]
R182  10K  R0603  [R0603]
R185  0R  R-0603  [R0603]
R186  0R  R-0603  [R0603]
R187  0R  R-0603  [R0603]
R188  0R  R-0603  [R0603]
R189  0R  R-0603  [R0603]
R190  0R  R-0603  [R0603]
R191  10K  R0603  [R0603]
R192  10K_NC  R0603  [R0603]
R193  10K_NC  R0603  [R0603]
R194  10K  R0603  [R0603]
R195  1K_NC  R0603  [R0603]
R196  0R  R0603  [R0603]
R197  0R  R0603  [R0603]
R198  0R_NC  R0603  [R0603]
R199  0R  R0603  [R0603]
R200  0R  R0603  [R0603]
R201  10K  R0603  [R0603]
R202  4.02K  R-0603  [R0603]
R203  0R  R-0603  [R0603]
R205  0R  R-0603  [R0603]
R206  0R  R-0603  [R0603]
R207  4.7K  R0603  [R0603]
R208  4.7K  R0603  [R0603]
R209  1K  R0603  [R0603]
R210  10K_NC  R0603  [R0603]
R211  0R  R-0603  [R0603]
R212  0R  R-0603  [R0603]
R213  0R  R-0603  [R0603]
R214  0R  R-0603  [R0603]
R215  0R  R-0603  [R0603]
R216  0R  R-0603  [R0603]
R217  0R  R-0603  [R0603]
R219  0R  R-0603  [R0603]
R220  0R  R-0603  [R0603]
R221  0R  R-0603  [R0603]
R222  0R  R-0603  [R0603]
R223  4.7K  RES-0603  [R0603-SP]
R224  4.7K  RES-0603  [R0603-SP]
R225  0R  R0603  [R0603]
R226  0R_NC  R0603  [R0603]
R227  0R  R0603  [R0603]
R228  0R  R0603  [R0603]
R230  0R  R0603  [R0603]
R231  0R  R-0603  [R0603]
R232  0R  R-0603  [R0603]
R234  100K  R0603  [R0603]
R235  100K  R0603  [R0603]
R236  100K  R0603  [R0603]
R237  10K  RESR0603  [R0603]
R238  10K_NC  RESR0603  [R0603]
R239  100K  R0603  [R0603]
R240  100K  R0603  [R0603]
R241  100K  R0603  [R0603]
R242  100K  R0603  [R0603]
R243  100K  R0603  [R0603]
R244  100K  R0603  [R0603]
R245  100K  R0603  [R0603]
R246  100K  R0603  [R0603]
R247  100K  R0603  [R0603]
R248  100K  R0603  [R0603]
R249  100K  R0603  [R0603]
R250  100K  R0603  [R0603]
R251  100K  R0603  [R0603]
R252  100K  R0603  [R0603]
R253  100K  R0603  [R0603]
R254  100K  R0603  [R0603]
R255  100K  R0603  [R0603]
R256  100K  R0603  [R0603]
R257  4.7K  RESR0603  [R0603]
R258  0R_NC  RESR0603  [R0603]
R259  4.7K  RESR0603  [R0603]
R260  0R_NC  RESR0603  [R0603]
R261  100K_NC  R0603  [R0603]
R262  100K_NC  R0603  [R0603]
R263  100K_NC  R0603  [R0603]
R264  100K  R0603  [R0603]
R265  100K  R0603  [R0603]
R266  100K_NC  R0603  [R0603]
R267  100K_NC  R0603  [R0603]
R268  100K_NC  R0603  [R0603]
R269  100K  R0603  [R0603]
R270  100K  R0603  [R0603]
R271  100K  R0603  [R0603]
R272  100K  R0603  [R0603]
R273  10K  R-0603  [R0603]
R274  100R  R-0603  [R0603]
R275  100K  R0603  [R0603]
R276  22R  R-0603  [R0603]
R277  100K  R0603  [R0603]
R278  100K_NC  R0603  [R0603]
R279  100K  R0603  [R0603]
R280  100K  R0603  [R0603]
R281  100K_NC  R0603  [R0603]
R282  100K_NC  R0603  [R0603]
R283  10K  R0603  [R0603]
R284  100K  R0603  [R0603]
R285  30K  R0603  [R0603]
R286  10K  RESR0603  [R0603]
R287  1K  RESR0603  [R0603]
R288  10K  RESR0603  [R0603]
R289  0R  R-0603  [R0603]
R290  0R  R-0603  [R0603]
R291  0R  R-0603  [R0603]
R292  0R  R-0603  [R0603]
R293  0R  R-0603  [R0603]
R294  0R  R-0603  [R0603]
R295  0R  R-0603  [R0603]
R296  0R  R-0603  [R0603]
R297  0R  R-0603  [R0603]
R298  0R  R-0603  [R0603]
R299  2K  R0603  [R0603]
R302  0R  R-0603  [R0603]
R305  0R  R-0603  [R0603]
R307  2K  R0603  [R0603]
R311  0R  R-0603  [R0603]
R312  0R  R-0603  [R0603]
R313  0R  R-0603  [R0603]
R315  0R  R-0603  [R0603]
R317  0R  R-0603  [R0603]
R324  0R  R-0603  [R0603]
R328  0R  R-0603  [R0603]
R329  0R_NC  RESR0603  [R0603]
R332  0R  R-0603  [R0603]
R422  4.7K  RESR0603  [R0603]
R423  4.7K  RESR0603  [R0603]
R639  1K  RESR0603  [R0603]
R652  1K  RESR0603  [R0603]
R653  2K  RESR0603  [R0603]
R654  3.6K  RESR0603  [R0603]
R655  8.2K  RESR0603  [R0603]
SW1  switch_6pin  SWITCH_6PIN_2P  [SWITCH_6PIN_2P]
SW2  switch_6pin  SWITCH_6PIN_2P  [SWITCH_6PIN_2P]
TP1  TPTP08R  [TP08R]
TP2  TPTP08R  [TP08R]
TP3  TPTP08R  [TP08R]
TP4  TPTP08R  [TP08R]
TP5  TPTP08R  [TP08R]
TP6  TPTP08R  [TP08R]
TP7  TPTP08R  [TP08R]
TP8  TPTP08R  [TP08R]
TP9  TPTP08R  [TP08R]
TP10  TPTP08R  [TP08R]
TP11  TPTP08R  [TP08R]
TP12  TPTP08R  [TP08R]
U1  ESP32-P4NRW32  [IC_ESP32-P4NRW32]
U2  RY3430_C370755  TLV62569DBVR  [SOT95P280X145-5N]
U3  RY3430_C370755  TLV62569DBVR  [SOT95P280X145-5N]
U4  IP101GR  [QFN32_4X4]
U5  DHT20  CROWTAIL-DHT20-V1.0-20211013_DHT20  [CROWTAIL-DHT20-V1.0-20211013_DHT20]
U6  LSM6DS3TR-C  LSM6DS3  [LGA-14L]
U7  HAL248  A1101  [SOT-23W]
U8  LMD4737T261  MIC  [MIC_LMD4737T261]
U9  NS4168-L  NS4168-ESOP-8  [NS4168-ESOP-8]
U10  NS4168-R  NS4168-ESOP-8  [NS4168-ESOP-8]
U11  MT9201  COOPER_MT9201  [COOPER_SOT23-6]
U12  CH340K  [ESOP-10-EP-150MIL]
U13  UMH3NTN  [SOP65P210X100-6N]
U14  WS2814A  [WS2814A]
U15  ME6211C18M5G-N_NC  ME6211C18M5G-N  [SOT95P282X145-5N]
U16  SX1308  MT3608  [SOT95P280X145-6N]
U17  MT3540  [SOT95P280X145-5N]
U18  MT3608  [DBV_R-PDSO-G6]
U19  SGM3799_NC  IC_SGM3799_TQFN2.6X1.8_16L  [IC_SGM3799_TQFN2.6X1.8_16L]
U44  ETA6280S2F/RY2121  LPW5206B5F_SOT23-5  [IC_SOT23-5]
U101  BIS0001  TM2291  [SOP16]
U121  BH1750  B1750  [B1750]
U123  TTP223  [SOT23-6L]
U$196  MSOP10  [MSOP10]
Y1  40MHZ  X322540MPB4SI  [X322540MPB4SI]
Y2  X322525MSB4SI  XTAL-3225  [SMD3225]
Y4  32.768K  NORDIC_NRF_XTAL_32KHZ  [NORDIC_NRF_XTAL_3215_N]

## Nets
3.3V: J17.2 P34.P$1 R199.2
3V3_MIC: C69.2 FB1.2 R133.1 U8.6(VDD_6)
+5V_SYS_GAS: C67.2 J6.1(A) J6.2(H) J6.3(A) R126.2 SW1.2(2_COM2)
AUDIO_VDD_3V3: Q7.3(3_D) R135.2 R139.2
AVDD33: C55.2 C56.2 R59.1 U4.31(AVDD33)
BIT_P0.31_HAL: C65.1 P21.P$1 R123.1 R213.1 U7.2(VOUT)
CLK_N: R186.2 U1.37(DSI_CLKN)
CLK_P: R185.2 U1.38(DSI_CLKP)
COL: R79.1 R80.2 U4.4(COL/RMII)
COM: J123.2 K4.2
CRS: R81.1 R82.2 U4.20(CRS/LEDMOD)
CSI_3V3: C80.1 C81.1 R144.2 R145.1 R146.1 R147.1
CSI_CLK_N: J12.8 R156.2 TP5.TP
CSI_CLK_P: J12.9 R157.2 TP6.TP
CSI_D0_N: J12.2 R152.2 TP1.TP
CSI_D0_P: J12.3 R153.2 TP2.TP
CSI_D1_N: J12.5 R154.2 TP3.TP
CSI_D1_P: J12.6 R155.2 TP4.TP
CSICLK_N: R156.1 U1.45(CSI_CLKN)
CSICLK_P: R157.1 U1.44(CSI_CLKP)
CSID0_N: R152.1 U1.42(CSI_DATAN0)
CSID0_P: R153.1 U1.43(CSI_DATAP0)
CSID1_N: R154.1 U1.46(CSI_DATAN1)
CSID1_P: R155.1 U1.47(CSI_DATAP1)
DA1: J7.8(DATA1) P49.P$1 R127.1
DA2: J7.1(DATA2) P51.P$1 R131.1
DATA0_N: R190.2 U1.40(DSI_DATAN0)
DATA0_P: R189.2 U1.39(DSI_DATAP0)
DATA1_N: R188.2 U1.36(DSI_DATAN1)
DATA1_P: R187.2 U1.35(DSI_DATAP1)
DN_N: D019.2 J5.A7(DN1) J5.B7(DN2) R9.2
DP_P: D064.2 J5.A6(DP1) J5.B6(DP2) R8.2
DSI_CLK_N: J17.23 R186.1 TP11.TP
DSI_CLK_P: J17.24 R185.1 TP12.TP
DSI_DATA0_N: J17.17 R190.1 TP7.TP
DSI_DATA0_P: J17.18 R189.1 TP8.TP
DSI_DATA1_N: J17.20 R188.1 TP9.TP
DSI_DATA1_P: J17.21 R187.1 TP10.TP
DTR: R13.2 U12.4(DTR#) U13.4(E2)
EN_DCDC: R31.2 U1.79(EN_DCDC)
ESP_LDO_VO1: C21.2 R37.2 U1.71(VFB1/VO1)
ESP_LDO_VO2: C24.1 R40.2 U1.72(VFB2/VO2)
ESP_LDO_VO3: C47.2 R51.2 U1.73(VFB3/VO3)
ESP_LDO_VO4: C31.2 R44.2 U1.74(VFB4/VO4)
ESP_VDD_HP_1V2: R34.2 R48.2 R49.2 R50.2
FB_DCDC: C16.1 R32.2 R33.1 R203.1 U3.5(FB)
FLASH_CK: IC1.6(CLK) U1.32(FLASH_CK)
FLASH_CS: IC1.1(/CS) R38.1 U1.27(FLASH_CS)
FLASH_D: IC1.5(DI_(IO0)) U1.33(FLASH_D)
FLASH_HOLD: IC1.7(/HOLD_OR_/RESET_(IO3)) U1.31(FLASH_HOLD)
FLASH_Q: IC1.2(DO_(IO1)) U1.28(FLASH_Q)
FLASH_WP: IC1.3(/WP_(IO2)) U1.29(FLASH_WP)
GND: C1.2 C2.1 C3.2 C4.2 C5.2 C6.2 C7.1 C8.2 C9.1 C10.1 C11.1 C12.2 C14.1 C15.2 C17.1 C18.2 C19.1 C20.2 C21.1 C22.2 C23.2 C24.2 C25.2 C26.1 C27.2 C28.2 C29.2 C30.1 C31.1 C32.2 C33.2 C34.2 C35.1 C36.2 C37.1 C38.2 C39.2 C40.2 C41.2 C42.2 C43.2 C44.2 C45.2 C46.2 C47.1 C48.2 C49.2 C50.1 C51.1 C52.1 C53.2 C54.1 C55.1 C56.1 C57.1 C58.1 C59.1 C60.1 C61.1 C62.1 C63.1 C64.1 C65.2 C66.1 C67.1 C68.1 C69.1 C70.2 C71.2 C72.2 C73.1 C74.1 C75.2 C76.2 C77.2 C78.1 C79.1 C80.2 C81.2 C82.2 C83.1 C84.2 C85.1 C86.2 C87.2 C88.2 C89.2 C90.2 C91.2 C92.2 C94.2 C95.2 C98.2 C99.2 C100.2 C101.1 C102.1 C106.1 C107.2 C108.2 C109.2 C110.2 C111.2 C112.2 C113.2 C114.1 C115.2 C116.2 C117.1 C118.1 C119.1 C120.1 C121.1 C122.1 C195.2 C209.1 C212.1 C213.1 C225.1 D001.1 D002.1 D003.1 D004.2 D007.2 D016.2 D018.1 D019.1 D020.1 D063.1 D064.1 D065.1 IC1.4(GND) J1.A1(GND) J1.A12(GND) J1.B1(GND) J1.B12(GND) J1.P$9 J1.P$10 J1.P$11 J1.P$12 J3.4 J3.SS1 J3.SS2 J4.1(1.GND) J4.5 J4.6 J5.A1(GND) J5.A12(GND) J5.B1(GND) J5.B12(GND) J5.P$9 J5.P$10 J5.P$11 J5.P$12 J7.6(VSS) J7.G1 J7.G2 J7.G3 J7.G4 J8.4 J8.5 J8.6 J8.13 J8.17 J8.20 J9.16 J9.17 J9.20 J10.1 J11.3 J11.4 J12.1 J12.4 J12.7 J12.10 J12.16 J12.17 J13.6 J13.6-6 J14.P$1(1_GND) J15.3 J15.4 J17.3 J17.7 J17.8 J17.9 J17.10 J17.16 J17.19 J17.22 J17.25 J17.28 J17.31 J17.41 J17.42 J18.1 J19.1 J20.3(S) J21.1 J22.1 J23.1 J24.1 J101.3(G) K1.1 K2.2 K5.P$1 K6.P$1 K7.P$1 K8.P$1 LED6.- P20.P$1 P28.P$1 P29.P$1 P31.P$1 P65.P$1 Q115.2(E) R1.2 R4.1 R7.2 R10.1 R21.1 R22.1 R23.1 R24.1 R27.2 R29.2 R33.2 R57.1 R62.2 R64.2 R65.2 R73.1 R80.1 R82.1 R84.1 R87.1 R91.1 R107.1 R108.1 R119.1 R120.1 R124.1 R125.2 R132.2 R134.1 R143.1 R150.2 R158.2 R159.1 R160.2 R162.1 R163.1 R167.1 R169.1 R173.1 R175.1 R180.1 R182.1 R192.1 R194.1 R202.1 R234.2 R238.1 R252.2 R256.2 R261.2 R262.2 R263.2 R264.2 R265.2 R266.2 R267.2 R268.2 R269.2 R270.2 R271.2 R272.2 R273.1 R275.2 R277.2 R278.2 R279.2 R280.2 R281.2 R282.2 R285.1 R286.2 R288.2 R307.2 SW2.4(4_1A) U1.105(GND) U2.2(GND) U3.2(GND) U4.EXP(PAD) U5.3(GND) U6.6(GND) U6.7(GND) U7.3(GND) U8.1(GND_1) U8.3(GND_3) U9.7(GND) U9.9(PE) U10.7(GND) U10.9(PE) U11.2(2-GND) U12.3(GND) U12.EP U14.4(GND) U15.2(VSS) U16.2(2_GND) U17.2(2_GND) U18.2(GND) U19.6(6_GND) U44.2(2_GND) U101.7(VSS) U121.3(GND\) U123.2(GND) U$196.5(GND) Y1.2(GND_1) Y1.4(GND_2) Y2.2(GND) Y2.4(GND) ; supply symbol labelled POWER-OR-GND-_GND_POWER
IN1: C212.2 P101.1 U123.3(IN)
INT1: P22.P$1 U6.4(INT1)
INT2: P23.P$1 U6.9(INT2)
INT_TP: J17.4 P35.P$1 R227.2
IO2: U1.2(GPIO2) U19.4(4_COM2) U$196.3(CO+)
IO2_CLK: J16.3 J16.3-3 P45.P$1 R177.1 U19.3(3_NO2) U$196.9(L1+)
IO2_RTS: P18.P$1 R287.2 U19.5(5_NC2) U$196.7(L0+)
IO3_MIC_CLK: U1.3(GPIO3) U8.4(CLK_4)
IO4_MIC_DATA: U1.4(GPIO4) U8.5(DATA_5)
IO5_RESET_LCD: R151.1 R231.2 U1.5(GPIO5)
IO6_AUDIO_EN: Q7.1(1_G) R95.1 R294.1 U1.6(GPIO6)
IO7: R315.2 U1.7(GPIO7) U19.8(8_COM3) U$196.4(CO-)
IO7_CMD: J16.2 J16.2-2 P44.P$1 R178.1 U19.7(7_NO3) U$196.8(L1-)
IO7_HALL: R213.2 U19.9(9_NC3) U$196.6(L0-)
IO8_LED: P32.P$1 R148.1 R290.2 U1.8(GPIO8)
IO9: R220.2 R291.2 U1.10(GPIO9)
IO9_W_CLK: J13.2 J13.2-2 P27.P$1 R220.1
IO10: R221.2 R295.2 U1.11(GPIO10)
IO10_W_MISO: J13.3 J13.3-3 P26.P$1 R221.1
IO11: R222.2 R296.2 U1.12(GPIO11)
IO11_W_MOSI: J13.4 J13.4-4 P25.P$1 R222.1
IO12_US_ECHO: R299.2 U1.13(GPIO12)
IO13_US_TRIG: R212.2 U1.14(GPIO13)
IO14: R219.2 R324.2 U1.15(GPIO14)
IO14_W_BUSY: J16.6 J16.6-6 P40.P$1 R219.1
IO15: R5.2 R302.1 U1.16(GPIO15)
IO15_W: J16.5 J16.5-5 P41.P$1 R5.1
IO16_ADC_KEY: P16.P$1 R214.2 R639.2 R652.2 R653.2 R654.2 R655.2
IO17_ADC_MQ2: J6.4(B) J6.6(B) P17.P$1 R125.1 R215.2
IO18_I2C1_SDA: J17.5 P36.P$1 Q107.2(S) R103.2 R205.2 R208.2 R260.1 U5.2(SDA) U6.14(SDA) U121.4(SDA)
IO18_SDA: J10.3 J18.3 Q107.3(D) R259.2 R260.2
IO19_I2C1_SCL: J17.6 P37.P$1 Q106.2(S) R104.2 R206.2 R207.2 R258.1 U5.4(SCL) U6.13(SCL) U121.6(SCL)
IO19_SCL: J10.4 J18.4 Q106.3(D) R257.2 R258.2
IO20_LED_BK_EN: R160.1 R232.2 U11.4(4-EN)
IO21_I2S_LRCLK: R136.2 U1.23(GPIO21)
IO22_I2S_BCLK: R137.2 U1.24(GPIO22)
IO23_I2S_DSDIN: R138.2 U1.25(GPIO23)
IO24_PIR: P30.P$1 R112.1 U1.52(GPIO24)
IO25_SERVO: Q405.2(S) R211.2 R329.2 R422.1
IO32_UPDN: R230.1 U1.63(GPIO32)
IO33_SHLR: R225.1 U1.64(GPIO33)
IO35_BOOT: C8.1 K2.1 R17.1 R18.1 R70.2 U13.3(C2)
IO36: R94.2 U1.68(GPIO36)
IO39_SD_DO: J7.7(DO) P6.P$1 R128.1 R332.2
IO40_RESET_TP: R228.1 U1.81(GPIO40)
IO41_INT_TP: R227.1 R317.2 U1.82(GPIO41)
IO42_RELAY: P58.P$1 R274.2 U1.83(GPIO42)
IO43_SD_SCK: J7.5(SCLK) P7.P$1 R217.2
IO44_SD_CMD: J7.3(DI) P8.P$1 R129.1 R216.2
IO45_I2C2_SDA: J12.14 P69.P$1 R98.2 R313.2 U1.87(GPIO45)
IO46_I2C2_SCL: J12.13 P68.P$1 R97.2 R312.2 U1.88(GPIO46)
IO47_TX: J19.3 Q5.3(D) R223.2
IO47_UART_TX: Q5.2(S) R224.2 R297.2 U1.89(GPIO47)
IO48_RX: J19.4 Q6.3(D) R101.2
IO48_UART_RX: Q6.2(S) R100.2 R298.2 U1.90(GPIO48)
IO53_W_TX_CE: R171.2 R328.2 U1.97(GPIO53)
IO54_W_RX_IRQ: R170.2 R305.1 U1.98(GPIO54)
IO-5: J9.13 R231.1 R247.2
IO-6: J9.12 R246.2 R294.2
IO-7: J9.10 R244.2 R315.1
IO-8: J9.11 R245.2 R290.1
IO-9: J9.6 R240.2 R291.1
IO-10: J9.5 R239.2 R295.1
IO-11: J9.4 R236.2 R296.1
IO-14: J9.3 R235.2 R324.1
IO-15: J9.9 R243.2 R302.2
IO-26: J9.15 R249.2 R293.2
IO-27: J9.14 R248.2 R292.2
IO-41: J8.14 R253.2 R317.1
IO-45: J8.18 R254.2 R313.1
IO-46: J8.19 R255.2 R312.1
IO-47: J9.18 R250.2 R297.1
IO-48: J9.19 R251.2 R298.1
IO-53: J9.7 R241.2 R328.1
IO-54: J9.8 R242.2 R305.2
IO_DO_N: R12.1 U1.69(GPIO37)
IO_DO_P: R11.1 U1.70(GPIO38)
IOT_5V: J13.7 J13.7-7 L3.1
LCD_3V3: R195.2 R199.1 R200.2 R201.2
LCD_AVDD_9V6: C92.1 C93.1 D013.1 D014.2 J17.32 P14.P$1 R166.2 R168.2
LCD_VCOM_3V3: C94.1 C95.1 P15.P$1 R168.1 R169.2 R197.1 R198.1
LCD_VDD_1V8: C88.1 C89.1 P10.P$1 R141.2 R179.2 R181.2 R191.2 R193.2 R196.1 U15.5(VOUT)
LCD_VGH_18V: C99.1 C100.1 D016.1 J17.38 P12.P$1 R172.1 R173.2
LCD_VGL_-6V: C110.1 C111.1 D020.2 J17.37 P11.P$1 R174.1 R175.2
LED+: C84.1 C85.2 D010.- D012.1 P63.P$1 R176.1 U11.5(5-OV)
LED-: J17.33 J17.34 P64.P$1 R159.2 R163.2 U11.3(3-FB)
N$1: Q3.1(1_G) Q4.3(C1) R23.2
N$2: C6.1 R6.1 U1.1(GPIO1) Y4.2
N$3: C5.1 R6.2 U1.104(GPIO0) Y4.1
N$4: Q1.1(1_G) Q2.3(C1) R21.2
N$5: Q2.2(B2) Q2.5(B1) Q2.6(C2) R22.2
N$6: C43.1 C44.1 C45.1 C46.1 R52.1 U1.51(VCCA)
N$7: Q4.2(B2) Q4.5(B1) Q4.6(C2) R24.2
N$8: J1.B5(CC2) R4.2
N$9: J1.A5(CC1) R1.1
N$10: J5.A5(CC1) R7.1
N$11: R12.2 U12.9(RXD)
N$12: R11.2 U12.8(TXD)
N$13: R13.1 U13.2(B1)
N$14: R15.1 U1.103(CHIP_PU)
N$15: R14.1 U13.5(B2)
N$16: R17.2 U1.66(GPIO35)
N$17: D130.2(2_K) R307.1
N$18: R209.1 U44.4(4_EN)
N$19: J2.12(YLED+) R55.1
N$20: R25.1 U2.1(EN)
N$21: L1.1 U2.3(SW)
N$22: C13.2 C14.2 L1.2 P2.P$1 R26.1 R28.1
N$23: C13.1 R26.2 R27.1 U2.5(FB)
N$24: R31.1 R210.2 U3.1(EN)
N$25: L2.1 U3.3(SW)
N$26: C16.2 C17.2 L2.2 P3.P$1 R32.1 R34.1
N$27: R203.2 U1.78(FB_DCDC)
N$28: C15.1 R35.1 R210.1 U3.4(VIN)
N$29: C32.1 R45.1 U1.96(VDDPST_6)
N$30: J2.11(YLED-) R56.1
N$31: J2.7(NC1) J2.8(NC2) J2.M1(SHIELD1) J2.M2(SHIELD2) R57.2
N$32: C50.2 J2.4(TCT)
N$34: R74.2 U1.92(GPIO49)
N$35: C51.2 J2.5(RCT)
N$36: R75.2 U1.93(GPIO50)
N$37: R77.2 U1.58(GPIO29)
N$38: R85.1 U4.24(TEST_ON)
N$39: R76.2 U1.60(GPIO30)
N$40: R71.2 U1.65(GPIO34)
N$41: R78.2 U1.57(GPIO28)
N$42: R88.2 U1.94(GPIO51)
N$43: J2.10(GLED-) R62.1
N$44: J2.9(GLED+) R63.1
N$45: R68.2 U1.61(GPIO31)
N$46: LED1.+ R89.1
N$47: J14.P$3(3_TRIG) R212.1
N$48: R232.1 U1.22(GPIO20)
N$49: R214.1 U1.17(GPIO16)
N$50: C209.2 R113.1 U121.5(DVI)
N$51: R91.2 U14.5(5_DOUT)
N$52: R69.2 U1.95(GPIO52)
N$53: D009.2(C) U14.3(3_OUTB)
N$54: D11.1(A) R93.2
N$55: R65.1 U4.25(ISET)
N$56: D008.2(C) U14.2(2_OUTG)
N$57: D11.2(C) U14.1(1_OUTR)
N$58: R29.1 U44.3(3_SET)
N$59: D006.1(A) R96.2
N$60: J5.B5(CC2) R10.2
N$61: D006.2(C) U14.8(8_OUTW)
N$62: R142.2 R150.1 U18.3(FB)
N$63: D008.1(A) R99.2
N$64: R92.2 U14.7(7_VDD)
N$65: D022.A L7.2 U18.1(SW)
N$66: D009.1(A) R102.2
N$67: R117.1 U101.3(RR1)
N$68: C108.1 R117.2 U101.4(RC1)
N$69: R112.2 U101.2(VO)
N$70: R110.2 U101.6(RR2)
N$71: C107.1 R110.1 U101.5(RC2)
N$72: C104.2 R105.2 R105.3 U101.12(2OUT)
N$73: C104.1 R106.2 R116.2 U101.13(2IN-)
N$74: R109.2 U101.9(VC)
N$75: R108.2 U101.10(IB)
N$76: C101.2 J101.2(S) R107.2 R118.2
N$77: C103.2 C105.1 R111.1 U101.16(1OUT)
N$78: C105.2 R111.2 R114.2 U101.15(1IN-)
N$79: C103.1 R106.1
N$80: C225.2 R114.1
N$81: R115.2 U101.1(A)
N$82: R118.1 U101.14(1IN+)
N$83: R105.1 R116.1
N$84: R119.2 U6.2(SDX)
N$85: R120.2 U6.3(SCX)
N$86: R121.2 U6.12(CS)
N$87: R122.2 U6.1(SDO)
N$88: J6.5(H) R124.2
N$89: LED6.+ R126.1
N$90: R217.1 U1.84(GPIO43)
N$91: R216.1 U1.86(GPIO44)
N$92: R133.2 R134.2 U8.2(L/R_2)
N$93: R135.1 U10.1(CTRL)
N$94: P61.P$1 R136.1 U9.2(LRCLK) U10.2(LRCLK)
N$95: P60.P$1 R137.1 U9.3(BCLK) U10.3(BCLK)
N$96: P59.P$1 R138.1 U9.4(SDATA) U10.4(SDATA)
N$97: FB2.1 U10.8(VOP)
N$98: FB3.1 U10.5(VON)
N$99: R332.1 U1.80(GPIO39)
N$100: C78.2 FB4.2 J11.2 P54.P$1
N$101: R139.1 R143.2 U9.1(CTRL)
N$102: C97.2 D017.1 D018.2
N$103: R162.2 U$196.10(EN)
N$105: FB4.1 U9.8(VOP)
N$106: FB5.1 U9.5(VON)
N$107: C79.2 FB5.2 J11.1 P55.P$1
N$108: C74.2 FB3.2 J15.1 P57.P$1
N$109: J12.15 P70.P$1 R145.2
N$110: J12.11 P66.P$1 R146.2
N$111: J12.12 P67.P$1 R147.2
N$114: R158.1 U1.48(CSI_REXT)
N$121: D010.+ D012.2 L5.2 U11.1(1-SW)
N$122: C96.1 C97.1 D013.2 L4.2 U16.1(1_SW)
N$123: R164.2 U15.3(CE)
N$124: R165.2 U16.4(4_EN)
N$125: C96.2 D014.1 D015.2
N$126: C93.2 R166.1 R167.2 U16.3(3_FB)
N$127: J13.1 J13.1-1 P43.P$1 R171.1
N$128: J16.1 J16.1-1 P42.P$1 R170.1
N$129: C98.1 D015.1 R172.2
N$131: C109.1 D017.2 R174.2
N$132: J17.39 J17.40 R176.2
N$137: R205.1 U1.19(GPIO18)
N$138: R206.1 U1.20(GPIO19)
N$139: C73.2 FB2.2 J15.2 P56.P$1
N$140: R211.1 U1.53(GPIO25)
N$143: J17.12 J17.13 R196.2 R198.2
N$144: J17.11 R197.2
N$146: R202.2 U1.34(DSI_REXT)
N$150: R215.1 U1.18(GPIO17)
N$159: D023.2(2_K) R234.1
N$160: D024.2(2_K) R235.1
N$162: D025.2(2_K) R236.1
N$164: D026.2(2_K) R239.1
N$165: D027.2(2_K) R240.1
N$166: K8.P$2 R652.1
N$167: D028.2(2_K) R241.1
N$168: K7.P$2 R653.1
N$169: K6.P$2 R654.1
N$170: D029.2(2_K) R242.1
N$171: D030.2(2_K) R243.1
N$172: K5.P$2 R655.1
N$173: D031.2(2_K) R244.1
N$174: D032.2(2_K) R245.1
N$175: D033.2(2_K) R246.1
N$176: D034.2(2_K) R247.1
N$177: D035.2(2_K) R248.1
N$178: D036.2(2_K) R249.1
N$179: D037.2(2_K) R250.1
N$180: D038.2(2_K) R251.1
N$181: D039.2(2_K) R252.1
N$182: D040.2(2_K) R253.1
N$183: D041.2(2_K) R254.1
N$184: D042.2(2_K) R255.1
N$185: D043.2(2_K) R256.1
N$186: D044.2(2_K) R261.1
N$187: D045.2(2_K) R262.1
N$188: D046.2(2_K) R263.1
N$189: D047.2(2_K) R264.1
N$190: D048.2(2_K) R265.1
N$191: D049.2(2_K) R266.1
N$192: D050.2(2_K) R267.1
N$193: D051.2(2_K) R268.1
N$194: D052.2(2_K) R269.1
N$195: D053.2(2_K) R270.1
N$196: D054.2(2_K) R271.1
N$197: D055.2(2_K) R272.1
N$198: D056.2(2_K) R275.1
N$199: D057.2(2_K) R277.1
N$200: D058.2(2_K) R278.1
N$201: D059.2(2_K) R279.1
N$202: D060.2(2_K) R280.1
N$203: D061.2(2_K) R281.1
N$204: D062.2(2_K) R282.1
N$241: R148.2 U14.6(6_DIN)
N$242: R149.2 U101.8(!RESET)
N$243: R283.2 U17.4(4_EN)
N$245: D066.+ L6.2 U17.1(1_SW)
N$246: J9.1 J9.2 R289.2
N$247: R284.1 R285.2 U17.3(3_FB)
N$254: J8.1 J8.2 J8.3 R311.1
N$258: R237.1 R238.2 U121.2(ADDR)
N$259: Q115.1(B) R273.2 R274.1
N$264: R288.1 U123.4(AHLB) U123.6(TOG)
N$267: R286.1 R287.1 U123.1(OUT)
N$278: J14.P$2(2_ECHO) R299.1
NC: J123.1 K4.4
NO: J123.3 K4.5
PHY_3V3: R55.2 R58.2 R59.2 R60.2 R61.2 R66.2 R67.2 R72.2 R79.2 R81.2 R83.2 R85.2 R86.2
PHY_AD0: R56.2 R61.1 U4.11(LED0/PHY_AD0)
PHY_AD3: R63.2 R64.1 U4.12(LED3/PHY_AD3)
PHY_CLK_IO50: R75.1 U4.10(TXCLK/50M_CLKI) U4.14(RXCLK/50M_CLKO)
PHY_MDC_IO31: R66.1 R68.1 U4.22(MDC)
PHY_MDIO_IO52: R67.1 R69.1 U4.23(MDIO)
PHY_RSTN_IO51: R86.1 R87.2 R88.1 U4.32(RESET_N)
PHY_RXD0_IO29: R77.1 U4.18(RXD0)
PHY_RXD1_IO30: R76.1 U4.17(RXD1)
PHY_RXDV_IO28: R78.1 U4.19(RXDV/CRS_DV)
PHY_TXD0_IO34: R71.1 U4.9(TXD0)
PHY_TXD1_IO35: R70.1 U4.8(TXD1)
PHY_TXEN_IO49: R74.1 U4.5(TXEN)
REGOUT: C59.2 C60.2 U4.28(REGOUT)
RESET_LCD: C112.1 J17.14 P38.P$1 R151.2 R193.1 R194.2 R195.1 R226.2
RESET_TP: C113.1 J17.1 P33.P$1 R201.1 R228.2
RST_EN: C3.1 K1.2 R15.2 R16.1 R226.1 U13.6(C1)
RTS: R14.2 U12.6(RTS#) U13.1(E1)
RX_N: J2.6(RD-) U4.26(MDI_RN)
RX_P: J2.3(RD+) U4.27(MDI_RP)
RXER: R83.1 R84.2 U4.21(RXER/INTR_32)
SDCS: J7.2(CS) P50.P$1 R130.1 R132.1
SEL: P48.P$1 R161.1 SW2.5(5_COM1) U19.2(2_IN1_2) U19.10(10_IN3_4) U$196.2(SEL)
SERVO: J3.1 J20.1(G) P71.P$1 Q405.3(D) R329.1 R423.2
SHLR: J17.35 P46.P$1 R181.1 R182.2 R225.2
STBYB: J17.15 P39.P$1 R191.1 R192.2
TX_N: J2.2(TD-) U4.29(MDI_TN)
TX_P: J2.1(TD+) U4.30(MDI_TP)
TXER: R72.1 R73.2 U4.1(TXER/FXSD)
UPDN: J17.36 P47.P$1 R179.1 R180.2 R230.2
USB1_5V: C9.2 D063.2 J5.A4(VBUS) J5.A9(VBUS) J5.B4(VBUS) J5.B9(VBUS) P4.P$1 Q1.3(3_D) Q2.1(E2)
USB1_D_N: R9.1 U12.2(UD-)
USB1_D_P: R8.1 U12.1(UD+)
USB2_5V: C11.2 D002.2 J1.A4(VBUS) J1.A9(VBUS) J1.B4(VBUS) J1.B9(VBUS) P5.P$1 Q3.3(3_D) Q4.1(E2)
USB2_D_N: D004.1 J1.A7(DN1) J1.B7(DN2) R3.2
USB2_D_P: D007.1 J1.A6(DP1) J1.B6(DP2) R2.2
USB2_N: D001.2 J4.3(3.D-) R20.2
USB2_P: D003.2 J4.2(2.D+) R19.2
USB_5V: C12.1 C106.2 L6.1 P1.P$1 Q1.2(2_S) Q2.4(E1) Q3.2(2_S) Q4.4(E1) R25.2 R90.1 R283.1 U2.4(VIN) U17.5(5_VIN)
USB_A_N: R3.1 R293.1 U1.55(GPIO26)
USB_A_P: R2.1 R292.1 U1.56(GPIO27)
USBD_N: R20.1 U1.49(DM)
USBD_P: R19.1 U1.50(DP)
V+: K4.1 R276.2
V-: D005.+ K4.3 LED1.- Q115.3(C)
VBAT: C49.1 C115.1 R54.1 U1.102(VBAT)
VBUS_OUT: C116.1 D065.2 J4.4(4.VCC) P9.P$1 U44.1(1_OUT)
VCC_5V_SERVO: C119.2 C120.2 C121.2 D021.- D022.C J3.3 J20.2(V) P52.P$1 R142.1 R423.1
VCC_RELAY: C61.2 D005.- FB9.1 R89.2 R276.1
VDD_3V3: C1.1 C2.2 C62.2 C63.2 C64.2 C66.2 C68.2 C70.1 C71.1 C72.1 C75.1 C76.1 C77.1 C102.2 C122.2 C213.2 D023.1(1_A) D024.1(1_A) D025.1(1_A) D026.1(1_A) D027.1(1_A) D028.1(1_A) D029.1(1_A) D030.1(1_A) D031.1(1_A) D032.1(1_A) D033.1(1_A) D034.1(1_A) D035.1(1_A) D036.1(1_A) D037.1(1_A) D038.1(1_A) D039.1(1_A) D040.1(1_A) D041.1(1_A) D042.1(1_A) D043.1(1_A) D044.1(1_A) D045.1(1_A) D046.1(1_A) D047.1(1_A) D048.1(1_A) D049.1(1_A) D050.1(1_A) D051.1(1_A) D052.1(1_A) D053.1(1_A) D054.1(1_A) D055.1(1_A) D056.1(1_A) D057.1(1_A) D058.1(1_A) D059.1(1_A) D060.1(1_A) D061.1(1_A) D062.1(1_A) FB1.1 J7.4(VDD) J13.5 J13.5-5 J101.1(D) P13.P$1 P19.P$1 P24.P$1 Q5.1(G) Q6.1(G) Q7.2(2_S) Q106.1(G) Q107.1(G) Q405.1(G) R28.2 R30.1 R58.1 R95.2 R97.1 R98.1 R100.1 R103.1 R104.1 R109.1 R113.2 R115.1 R121.1 R122.1 R123.2 R127.2 R128.2 R129.2 R130.2 R131.2 R140.1 R141.1 R144.1 R149.1 R161.2 R177.2 R178.2 R200.1 R207.1 R208.1 R224.1 R237.2 R311.2 R422.2 R639.1 U5.1(VCC) U6.5(VDDIO) U6.8(VDD) U7.1(VCC) U9.6(VDD) U10.6(VDD) U12.7(VCC) U12.10(V3) U19.14(14_VCC) U101.11(VDD) U121.1(VCC) U123.5(VCC) U$196.1(VCC)
VDD_5V: C10.2 C52.2 C82.1 C83.2 C86.1 C87.1 C90.1 C91.1 C117.2 C118.2 D021.+ D130.1(1_A) FB9.2 J10.2 J14.P$4(4VCC) J18.2 J19.2 L3.2 L4.1 L5.1 L7.1 R35.2 R90.2 R92.1 R93.1 R96.1 R99.1 R101.1 R102.1 R164.1 R165.1 R223.1 R257.1 R259.1 R289.1 SW1.3(3_2A) U11.6(6-VIN) U15.1(VIN) U16.5(5_IN) U18.4(EN) U18.5(IN)
VDD_5V2: C114.2 C195.1 D066.- P62.P$1 R209.2 R284.2 U44.5(5_VIN)
VDD_ESP32: R18.2 R30.2 R43.2 R46.2 R47.2 R52.2 R94.1
VDD_ESP32_1: R16.2 R36.2 R41.2 R42.2 R45.2 R53.2 R54.2 R140.2
VDD_FLASH: C20.1 IC1.8(VCC) R38.2 R39.2
VDD_HP_0: C36.1 C37.2 R48.1 U1.26(VDD_HP_0)
VDD_HP_2: C38.1 R49.1 U1.76(VDD_HP_2)
VDD_HP_3: C39.1 R50.1 U1.91(VDD_HP_3)
VDD_IO: C57.2 C58.2 R60.1 U4.13(VDD_IO)
VDD_MIPI_DPHY: C40.1 C41.1 C42.1 R51.1 U1.41(VDD_MIPI_DPHY)
VDDA: C48.1 R53.1 U1.101(VDDA)
VDDPST: C22.1 C23.1 R40.1 U1.59(VDDPST) U1.67(VDDPST)
VDDPST_1: C25.1 C26.2 R41.1 U1.9(VDDPST_1)
VDDPST_2: C27.1 R42.1 U1.21(VDDPST_2)
VDDPST_3: C18.1 C19.2 R36.1 R37.1 R39.1 U1.30(VDDPST_3)
VDDPST_4: C28.1 R43.1 U1.62(VDDPST_4)
VDDPST_5: C29.1 C30.2 R44.1 U1.85(VDDPST_5)
VDDPST_DCDC: C34.1 C35.2 R47.1 U1.77(VDDPST_DCDC)
VDDPST_LDO: C33.1 R46.1 U1.75(VDDPST_LDO)
XIN: C53.1 U4.3(X2) Y2.1(XIN)
XOUT: C54.2 U4.2(X1) Y2.3(XOUT)
XTAL_N: C7.2 U1.99(XTAL_N) Y1.3(CRYSTAL_2)
XTAL_P: C4.1 U1.100(XTAL_P) Y1.1(CRYSTAL_1)
Unconnected: J1.A8(SBU1) J1.B8(SBU2) J3.2 J5.A8(SBU1) J5.B8(SBU2) J7.9(CDN) J8.7 J8.8 J8.9 J8.10 J8.11 J8.12 J8.15 J8.16 J16.4 J16.4-4 J16.7 J16.7-7 J17.26 J17.27 J17.29 J17.30 SW1.1(1_2B) SW1.4(4_1A) SW1.5(5_COM1) SW1.6(6_1B) SW2.1(1_2B) SW2.2(2_COM2) SW2.3(3_2A) SW2.6(6_1B) U1.54(NC) U4.6(TXD3) U4.7(TXD2) U4.15(RXD3) U4.16(RXD2) U12.5(CTS#) U15.4(NC) U16.6(6_NC) U18.6(NC) U19.1(1_NC1) U19.11(11_NO4) U19.12(12_COM4) U19.13(13_NC4) U19.15(15_NO1) U19.16(16_COM1)

## Notes on the sheet
- ESP32-P4 | USB_TypeC *2 & TypeA | USB to UART
- LCD_Interface Board
- ESP32-P4_POWER
- POWER
- DC-DC:5V to 3V3 | TypeA Limit Current
- 2A
- I=6.8/R
- Limit current 520mA
- DC-DC:3V3 to 1V2
- 2A
- LED | 3 | Relay | 15 | PHY
- Temperature &
  Humidity(DHT20)
- I2C | ADDRESS:0X38
- DC-DC:5V to 5V2
- 4
- DSI_LED Driver
- 3V-5.5V
- LDO:5V/3.3V to 1V8
- Servo Motor | Ultrasonic Sensor | I led=200mV/1.1=182mA
- 7 | PIR | 6
- 1
- DC-DC:LCD_POWER
- LIGHT SENSOR
- I2C | ADD:0X5C
- 2
- IO_LED
- Accelerometer & Gyro
- HALL SENSOR | 9
- I2C | ADD:0X6B
- 2.7V-4.2V
- ADDRESS:1011100
- 8
- ADDRESS:0x5C
- 2.7V-4.2V
- SD card | 5
- GAS-MQ2 | DSI_Interface
- SPI
- ADC
- 开关控制热释电功能的开启或关闭 | 14
- Custom_key
- Touch Sensor
- ADC
- 10 | 11
- TTP223
- Wireless module | MIC | Audio_Interface
- 12 | 13
- SPI；I2C；TX、RX | CSI_Interface
- I2S
- 16
- I2C | UART
- RS2227XN

## Library data of the parts
C1-C49 C55-C60 C63 C70-C81 C86-C89 C91 C93-C100 C106 C109-C116 C195 = cooper:C0603
C50-C52 C61 C64-C67 C69 C85 C102 C118 C121 C122 C209 C213 = RC:C0603
C53 C54 C62 C212 C225 = Brian:CAP*
C68 C82-C84 = CrowPanel_Advance_HMI:CAP*
C90 C92 = SX1302_Module:C0805
C101 C104 C105 C107 C108 = Discrete:C*: Ceramic Capacitors
C103 = A_xbj:C0603
C117 C119 C120 = SX1302_Module:CAP*
D001 D003 D004 D007 = H5VL10B:H5VL10B
D002 D019 D063-D065 = LESD5D5.0CT1G:LESD5D5.0CT1G: Check availability <https://pricing.snapeda.com/parts/LESD5D5.0CT1G/Leshan%20Radio%20Co./view-part?ref=eda>; AVAILABILITY: In Stock; CHECK_PRICES: https://www.snapeda.com/parts/LESD5D5.0CT1G/Leshan+Radio/view-part/?ref=eda; DESCRIPTION: Transient Voltage Suppressors for ESD Protection; MF: Leshan Radio Co.; MP: LESD5D5.0CT1G; PACKAGE: None; PRICE: None; SNAPEDA_LINK: https://www.snapeda.com/parts/LESD5D5.0CT1G/Leshan+Radio/view-part/?ref=snap
D005 = Crowtail_Starter:DIODE*
D006 D008 D009 D11 = Crowtail_Starter:LED: LED (Generic) Standard schematic elements and footprints for 5mm, 3mm, 1206, and 0603 sized LEDs. Generic LEDs with no color specified.
D010 D021 D066 = CrowPanel_Advance_HMI:DIODE*
D012-D015 D017 D018 = LMBR140ET1G:LMBR140ET1G
D016 D020 = LMSZ5233BT1G_MM1W18:LMSZ5233BT1G
D022 = diode:CGRM400*-G: Molded plasitc,JEDEC SOD-123/Mini SMA Source: Comchip CGRM4001-G.pdf
D023-D062 D130 = cooper:LED_0603_SMT
FB1-FB5 = CrowPanel_Advance_HMI:FB*
FB9 = Brian:FB*
IC1 = W25Q128JVSIQ:W25Q128JVSIQ: 128M-bit Serial Flash Memory with uniform 4KB sectors and Dual/Quad SPI Source: Datasheet <https://www.winbond.com/hq/search-resource-file.jsp?partNo=W25Q128JVSIQ&type=datasheet>; ARROW_PART_NUMBER: W25Q128JVSIQ; ARROW_PRICE-STOCK: https://www.arrow.com/en/products/w25q128jvsiq/winbond-electronics?utm_currency=USD&region=nac; DESCRIPTION: 128M-bit Serial Flash Memory with uniform 4KB sectors and Dual/Quad SPI; HEIGHT: 2.16mm; MANUFACTURER_NAME: Winbond; MANUFACTURER_PART_NUMBER: W25Q128JVSIQ; MOUSER_PART_NUMBER: 454-W25Q128JVSIQ; MOUSER_PRICE-STOCK: https://www.mouser.co.uk/ProductDetail/Winbond/W25Q128JVSIQ?qs=qSfuJ%252Bfl%2Fd6tLXvPR4fl9w%3D%3D
J1 J5 = CrowPanel Pico Display-2.4_V1.0_240412:WZ3532R024-ESP32-V0.1-20221226_USB_TYPE-C_16PIN
J2 = ThinkNode-G3_8-Channel Gateway_Power By ESP32&SX1302_PRD_V0.2:LORA_BASIC_GATEWAY_-MODULE_HR911105A-RJ45
J3 = CrowPanel ESP32 Display-4.3-inch-V2.1-20240314:A_XBJ_CONNECTOR_TWIG-4P-2.0-SMD-FEMALE-REINFORCE
J4 = C42605_Type_A:C42605/USB2.0
J6 = Brian:MQ-SOCKET
J7 = CrowPanel_Advance_HMI:HOLDER-MICROSD-9P
J8 J9 = SparkFun-Connectors:CONN_20: Multi connection point. Often used as Generic Header-pin footprint for 0.1 inch spaced/style header connections On any of the 0.1 inch spaced packages, you can populate with these: Break Away Headers - Straight <https://www.sparkfun.com/products/116> (PRT-00116) Break Away Male Headers - Right Angle <https://www.sparkfun.com/products/553> (PRT-00553) Female Headers <https://www.sparkfun.com/products/115> (PRT-00115) Break Away Headers - Machine Pin <https://www.sparkfun.com/products/117> (PRT-00117) Break Away Female Headers - Swiss Machine Pin <https://www.sparkfun.com/products/743> (PRT-00743) For SCREWTERMINALS and SPRING TERMINALS visit here: Screw Terimnals on SparkFun.com <https://www.sparkfun.com/search/results?term=Screw+Terminals> (5mm/3.5mm/2.54mm spacing) This device is also useful as a general connection point to wire up your design to another part of your project. Our various solder wires solder well into these plated through hole pads. Hook-Up Wire - Assortment (Stranded, 22 AWG) <https://www.sparkfun.com/products/11375> (PRT-11375) Hook-Up Wire - Assortment (Solid Core, 22 AWG) <https://www.sparkfun.com/products/11367> (PRT-11367) View the entire wire category on our website here <https://www.sparkfun.com/categories/141> Special notes: Molex polarized connector foot print use with SKU : PRT-08231 with associated crimp pins and housings. 1MM SMD Version SKU: PRT-10208 NOTES ON THE VARIANTS LOCK and LOCK_LONGPADS... This footprint was designed to help hold the alignment of a through-hole component (i.e. 6-pin header) while soldering it into place. You may notice that each hole has been shifted either up or down by 0.005 of an inch from it's more standard position (which is a perfectly straight line). This slight alteration caused the pins (the squares in the middle) to touch the edges of the holes. Because they are alternating, it causes a "brace" to hold the component in place. 0.005 has proven to be the perfect amount of "off-center" position when using our standard breakaway headers. Although looks a little odd when you look at the bare footprint, once you have a header in there, the alteration is very hard to notice. Also,if you push a header all the way into place, it is covered up entirely on the bottom side. Note about LOCK SPECIAL package: This is just like the LOCK variant in that the holes are staggared by 5 mil, but except for the last two holes. They are not altered from the "standard" footprint layout. This is used for a special purpose on the layout of our Graphic LCD Backpack. Make sure you want to use this device before selecting it for you project!
J10 J18 J19 = CONNECTER:TWIG_2.0
J11 J15 = Crotail:1X02L
J12 = FPC:C262349_15P_1MM_下接_AFA07-S15FCC-00
J13 J16 = CrowPanel_Advance_HMI:HEADER-7P
J14 = Crowtail_Starter_V0.2:CROWPI_POW_ULTRA
J17 = FPC:C19273935_40P_0.5MM_下接_HC-FPC-0.5-40P-FH20
J20 = Brian:CON-2.54MM-1*3P-WT-SG90
J21 J22 = SparkFun-Connectors:CONN_01_3.1MM_SMD: Single connection point. Often used as Generic Header-pin footprint for 0.1 inch spaced/style header connections On any of the 0.1 inch spaced packages, you can populate with these: Break Away Headers - Straight <https://www.sparkfun.com/products/116> (PRT-00116) Break Away Male Headers - Right Angle <https://www.sparkfun.com/products/553> (PRT-00553) Female Headers <https://www.sparkfun.com/products/115> (PRT-00115) Break Away Headers - Machine Pin <https://www.sparkfun.com/products/117> (PRT-00117) Break Away Female Headers - Swiss Machine Pin <https://www.sparkfun.com/products/743> (PRT-00743) This device is also useful as a general connection point to wire up your design to another part of your project. Our various solder wires solder well into these plated through hole pads. Hook-Up Wire - Assortment (Stranded, 22 AWG) <https://www.sparkfun.com/products/11375> (PRT-11375) Hook-Up Wire - Assortment (Solid Core, 22 AWG) <https://www.sparkfun.com/products/11367> (PRT-11367) View the entire wire category on our website here <https://www.sparkfun.com/categories/141> Special notes: SMTSO-256-ET is a "flush mount" nut for a 4-40 screw. We mostly use this on specialty testbeds; it is a nice way to connect hardware to your PCB at an adjustable hieght. Also note, the SNAP packages are for using a snappable style connector. We sell a baggie of snaps and they are also used on two LilyPad designs: Snap Assortment - 30 pack (male and female) <https://www.sparkfun.com/products/11347> (DEV-11347) LilyPad Arduino SimpleSnap <https://www.sparkfun.com/products/10941> (DEV-10941) LilyPad SimpleSnap Protoboard <https://www.sparkfun.com/products/10940> (DEV-10940)
J23 J24 = SparkFun-Connectors2.6:CONN_01_2.6MM: Single connection point. Often used as Generic Header-pin footprint for 0.1 inch spaced/style header connections On any of the 0.1 inch spaced packages, you can populate with these: Break Away Headers - Straight <https://www.sparkfun.com/products/116> (PRT-00116) Break Away Male Headers - Right Angle <https://www.sparkfun.com/products/553> (PRT-00553) Female Headers <https://www.sparkfun.com/products/115> (PRT-00115) Break Away Headers - Machine Pin <https://www.sparkfun.com/products/117> (PRT-00117) Break Away Female Headers - Swiss Machine Pin <https://www.sparkfun.com/products/743> (PRT-00743) This device is also useful as a general connection point to wire up your design to another part of your project. Our various solder wires solder well into these plated through hole pads. Hook-Up Wire - Assortment (Stranded, 22 AWG) <https://www.sparkfun.com/products/11375> (PRT-11375) Hook-Up Wire - Assortment (Solid Core, 22 AWG) <https://www.sparkfun.com/products/11367> (PRT-11367) View the entire wire category on our website here <https://www.sparkfun.com/categories/141> Special notes: SMTSO-256-ET is a "flush mount" nut for a 4-40 screw. We mostly use this on specialty testbeds; it is a nice way to connect hardware to your PCB at an adjustable hieght. Also note, the SNAP packages are for using a snappable style connector. We sell a baggie of snaps and they are also used on two LilyPad designs: Snap Assortment - 30 pack (male and female) <https://www.sparkfun.com/products/11347> (DEV-11347) LilyPad Arduino SimpleSnap <https://www.sparkfun.com/products/10941> (DEV-10941) LilyPad SimpleSnap Protoboard <https://www.sparkfun.com/products/10940> (DEV-10940)
J101 = PIR_motion_sensor:LHI778: Pyroelectric Infrared Detectors
J123 = Crowtail_Starter:3.5MM*3P
K1 K2 = CrowPanel_Advance_HMI:KEY-6
K4 = Discrete-new:RELAY-SRD
K5-K8 = crowpi_pow:BUTTON_2P
L1 L2 L4-L6 = SparkFun-Coils:4.7μH_SHIELDED_INDUCTOR: 4.7uH Inductor 4.7uH 1.4A 50mOhm 1008(2520) Package Shielded; PROD_ID: NDUC-14880
L3 = CrowPanel_Advance_HMI:L*
L7 = inductor-neosid:MS42: INDUCTOR SMD inductor
LED1 LED6 = A_xbj:DISCRETE_LED*
P1-P52 P54-P71 = CrowPanel_Advance_HMI:TEST_PAD*
P101 = Discrete:PAD
Q1 Q3 Q7 = AO3401A:AO3401A: Check availability <https://pricing.snapeda.com/parts/AO3401A/UMW/view-part?ref=eda>; AVAILABILITY: In Stock; CHECK_PRICES: https://www.snapeda.com/parts/AO3401A/UMW/view-part/?ref=eda; DESCRIPTION: P-Channel 30 V 4.2A (Ta) 1.4W (Ta) Surface Mount SOT-23; MF: UMW; MP: AO3401A; PACKAGE: TO-236-3 Alpha &amp; Omega Semiconductor Inc.; PRICE: None; SNAPEDA_LINK: https://www.snapeda.com/parts/AO3401A/UMW/view-part/?ref=snap
Q2 Q4 = C13962_LMBT3906DW1T1G:LMBT3906DW1T1G
Q5 Q6 = RC:MOSFET-N: IRLL014: http://www.vishay.com/docs/91319/sihll014.pdf
Q106 Q107 = Discrete:MOSFET-N: IRLL014: http://www.vishay.com/docs/91319/sihll014.pdf
Q115 = Discrete:TRANSISTOR-NPN*: NPN audion
Q405 = discrete:MOSFET-N: IRLL014: http://www.vishay.com/docs/91319/sihll014.pdf
R1-R24 R68-R71 R74-R78 R88 R91 R92 R148 R152-R158 R161 R162 R177 R178 R185-R190 R202 R203 R205 R206 R211 R212 R214-R217 R219-R222 R231 R232 R289-R298 R302 R305 R311-R313 R315 R317 R324 R328 R332 = discrete:R*
R25-R27 R29-R56 R58-R67 R72 R73 R79-R87 R94 R95 R97 R98 R103 R104 R133 R134 R140 R141 R144-R147 R151 R164-R169 R172-R176 R179-R182 R191-R201 R207-R210 R225-R228 R230 R234-R236 R239-R256 R261-R272 R275 R277-R285 R299 R307 = cooper:R0603
R28 R90 = SX1302_Module:RES*
R57 R89 R113 R119-R122 R124-R126 R142 R150 R237 R238 R257-R260 R286-R288 R329 R422 R423 R639 R652-R655 = Brian:RES*
R93 R96 R99 R102 R106-R112 R114-R118 R123 R149 R213 R273 R274 R276 = Discrete:R*
R100 R101 R127-R132 R135-R139 R143 R159 R160 R163 R170 R171 R223 R224 = CrowPanel_Advance_HMI:RES*
R105 = Discrete:R-POTENTIOMETER*: Potentiometer
SW1 SW2 = cooper:SWITCH_6PIN_2P
TP1-TP12 = testpad:TP: Test pad
U1 = ESP32-P4NRW32:ESP32-P4NRW32: Check availability <https://pricing.snapeda.com/parts/ESP32-P4NRW32/Espressif%20Systems/view-part?ref=eda>; AVAILABILITY: Not in stock; CHECK_PRICES: https://www.snapeda.com/parts/ESP32-P4NRW32/Espressif+Systems/view-part/?ref=eda; DESCRIPTION: 高性能 MCU，带有一个 RISC-V 32 位双核微处理器; MF: Espressif Systems; MP: ESP32-P4NRW32; PACKAGE: None; PRICE: None; SNAPEDA_LINK: https://www.snapeda.com/parts/ESP32-P4NRW32/Espressif+Systems/view-part/?ref=snap
U2 U3 = TLV62569DBVR:TLV62569DBVR: Check availability <https://pricing.snapeda.com/parts/TLV62569DBVR/Texas%20Instruments/view-part?ref=eda>; AVAILABILITY: In Stock; CHECK_PRICES: https://www.snapeda.com/parts/TLV62569DBVR/Texas+Instruments/view-part/?ref=eda; DESCRIPTION: 2.5V-5.5V input, 2-A high efficiency step-down buck converter in SOT23 and SOT563 package; MF: Texas Instruments; MP: TLV62569DBVR; PACKAGE: SOT-23-5 Texas Instruments; PRICE: None; SNAPEDA_LINK: https://www.snapeda.com/parts/TLV62569DBVR/Texas+Instruments/view-part/?ref=snap
U4 = IP101GR (1):IP101GR: Check availability <https://pricing.snapeda.com/parts/IP101GR/WIZnet/view-part?ref=eda>; AVAILABILITY: Not in stock; CHECK_PRICES: https://www.snapeda.com/parts/IP101GR/WIZnet/view-part/?ref=eda; DESCRIPTION: IP101GRI WIZnet; MF: WIZnet; MP: IP101GR; PACKAGE: None; PRICE: None; SNAPEDA_LINK: https://www.snapeda.com/parts/IP101GR/WIZnet/view-part/?ref=snap
U5 = Crowtail_Starter:CROWTAIL-DHT20-V1.0-20211013_DHT20
U6 = Brian:LSM6DS3
U7 = IC:A1101: Continuous-Time Switch
U8 = MIC_LMD4737T261:MIC
U9 U10 = STC_MCUSTC8G1K08A:NS4168-ESOP-8
U11 = CrowPanel_Advice_HMI 4.3:COOPER_MT9201
U12 = sale:CH340K
U13 = UMH3NTN:UMH3NTN: Dual NPN BJT with 4.7K Base resistor Datasheet <https://fscdn.rohm.com/en/products/databook/datasheet/discrete/transistor/digital/umh3ntn-e.pdf> BUY NOW <https://www.digikey.ca/en/products/detail/rohm-semiconductor/umh3ntn/659279> Check availability <https://pricing.snapeda.com/parts/UMH3NTN/Rohm/view-part?ref=eda>; AVAILABILITY: In Stock; CHECK_PRICES: https://www.snapeda.com/parts/UMH3NTN/Rohm/view-part/?ref=eda; DESCRIPTION: Pre-Biased Bipolar Transistor (BJT) 2 NPN - Pre-Biased (Dual) 50V 100mA 250MHz 150mW Surface Mount UMT6; MF: Rohm; MP: UMH3NTN; PACKAGE: SOT-363 Rohm; PRICE: None; PURCHASE-URL: https://www.snapeda.com/api/url_track_click_mouser/?unipart_id=355768&manufacturer=Rohm&part_name=UMH3NTN&search_term=umh3n; SNAPEDA_LINK: https://www.snapeda.com/parts/UMH3NTN/Rohm/view-part/?ref=snap
U14 = WS2814A:WS2814A
U15 = ME6211C18M(22M)5G-N:ME6211C18M5G-N: High Speed LDO Regulators, High PSRR, Low noise Source: Datasheet <https://datasheet.lcsc.com/lcsc/1809141122_MICRONE-Nanjing-Micro-One-Elec-ME6211C18M5G-N_C236671.pdf>; DESCRIPTION: High Speed LDO Regulators, High PSRR, Low noise; HEIGHT: 1.45mm; MANUFACTURER_NAME: Micron; MANUFACTURER_PART_NUMBER: ME6211C18M5G-N
U16 = MT3608:MT3608: High Efficiency 1.2MHz 2A Step Up Converter Source: Datasheet <https://www.olimex.com/Products/Breadboarding/BB-PWR-3608/resources/MT3608.pdf>; DESCRIPTION: High Efficiency 1.2MHz 2A Step Up Converter; HEIGHT: 1.45mm; MANUFACTURER_NAME: Aerosemi; MANUFACTURER_PART_NUMBER: MT3608
U17 = TLV62569DBVR_MT3406:MT3540
U18 = Library:MT3608
U19 = cooper:IC_SGM3799_TQFN2.6X1.8_16L
U44 = cooper:LPW5206B5F_SOT23-5
U101 = PIR_motion_sensor:TM2291: Infrared signal processor
U121 = b1750:B1750; B1750: B1750
U123 = Seeed:TTP223
U$196 = RC:MSOP10
Y1 = X322540MPB4SI_40MHZ:X322540MPB4SI: SMD Crystal Resonators 40MHz +/-10ppm SMD-3225_4P RoHS Source: Datasheet <https://datasheet.lcsc.com/szlcsc/Yangxing-Tech-X322540MPB4SI_C9010.pdf>; DESCRIPTION: SMD Crystal Resonators 40MHz +/-10ppm SMD-3225_4P RoHS; HEIGHT: 0.8mm; MANUFACTURER_NAME: Yangxing Tech; MANUFACTURER_PART_NUMBER: X322540MPB4SI
Y2 = LoraWAN_Gateway_Mainboard:XTAL-3225
Y4 = nRF52832_MCU:NORDIC_NRF_XTAL_32KHZ

## Net classes
1 power: width 1 mm, drill 0.3 mm, clearance 0.152 mm